# Altium project 8x8_Crosspoint_Switch.PrjPcb (part 2 of 4)

## Sheet 1-to-8_Fanout.SchDoc: 1:8 Fanout
size A3; Author: M.Beldyga; CompanyName: WUT ISE; DrawnBy: M.Beldyga; Organization: WUT ISE; Address1: PW ISE; Address2: Nowowiejska 15/19 00-665 Warsaw; Address3: micbeldyga@gmail.com; SheetNumber: 3; SheetTotal: 8; ModifiedBy: -; CheckedDate: -; DivGrp: WUT ISE; Designer: M.Beldyga; ModifiedDate: -; ProjectName: Sensor Box
Used 8 times, as channels U_Crosspoint/U_1-to-8_Fanout, U_Crosspoint/U_1-to-8_Fanout, U_Crosspoint/U_1-to-8_Fanout, U_Crosspoint/U_1-to-8_Fanout, U_Crosspoint/U_1-to-8_Fanout, U_Crosspoint/U_1-to-8_Fanout, U_Crosspoint/U_1-to-8_Fanout, U_Crosspoint/U_1-to-8_Fanout. Parts and nets are listed once, with the designators drawn on the sheet.
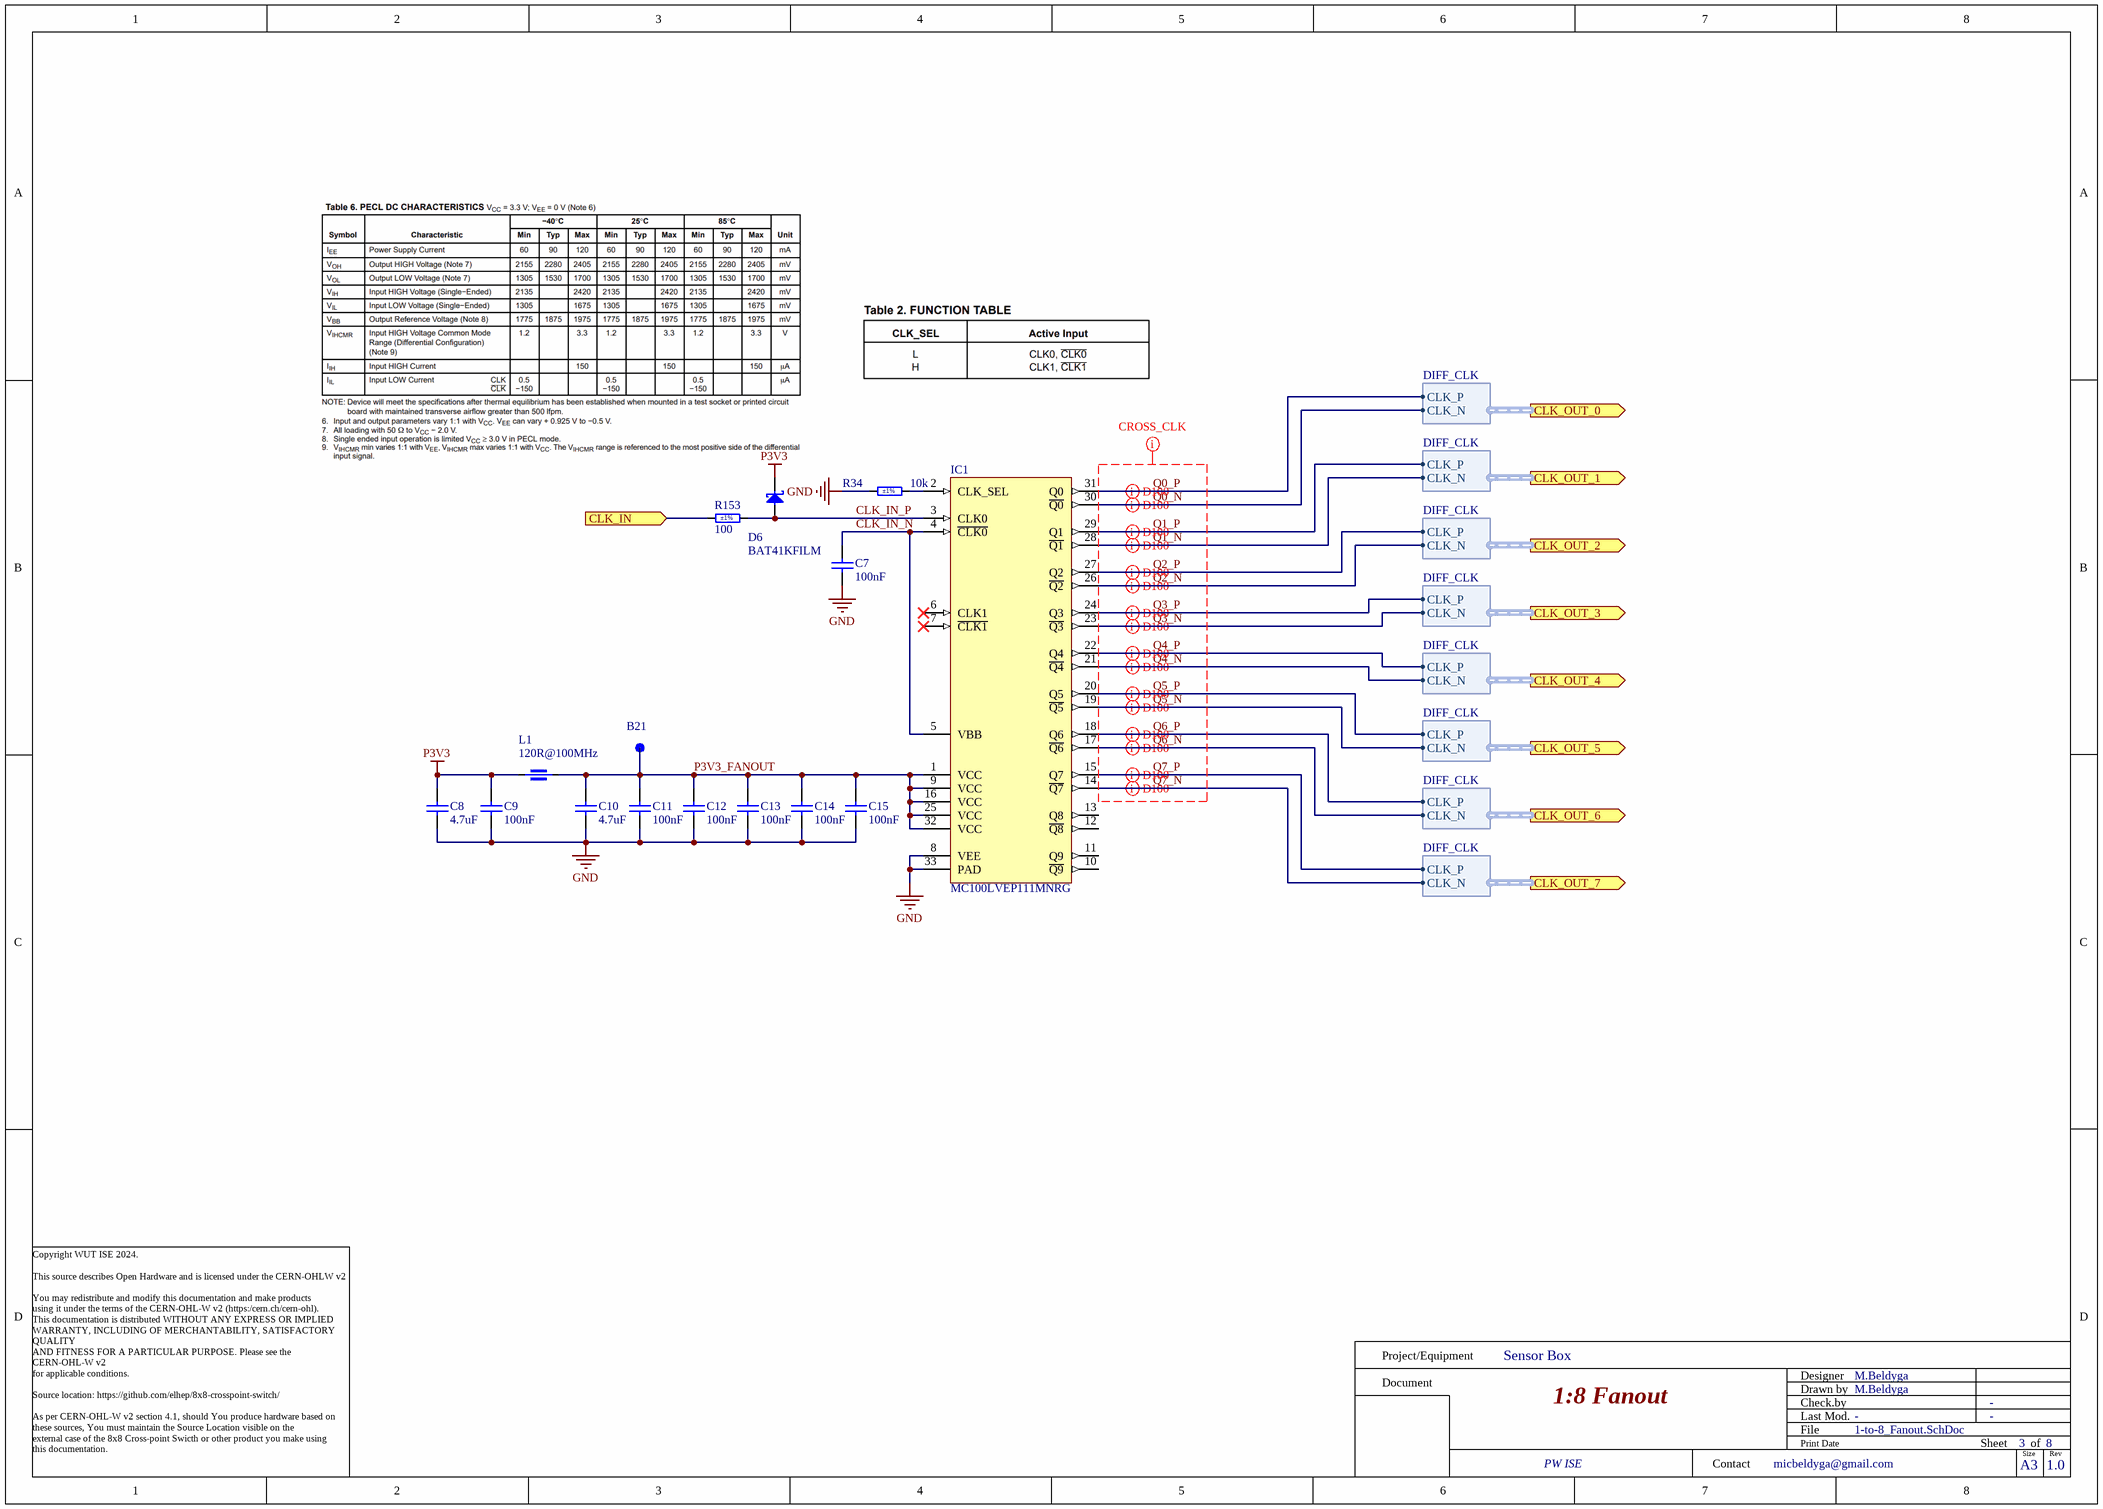
[diagram p2: 1-to-8_Fanout.SchDoc]

### Parts
B21  SMD Pad  [C100]  (value not drawn)  (no BOM)
C7  100nF  [CAPC1005X55N]
C8  4.7uF  [CAPC1608X90N]
C9  100nF  [CAPC1005X55N]
C10  4.7uF  [CAPC1608X90N]
C11  100nF  [CAPC1005X55N]
C12  100nF  [CAPC1005X55N]
C13  100nF  [CAPC1005X55N]
C14  100nF  [CAPC1005X55N]
C15  100nF  [CAPC1005X55N]
D6  BAT41KFILM  [SODFL1608X70N]
IC1  MC100LVEP111MNRG  [QFN50P500X500X100_HS-33N]
L1  120R@100MHz  [INDC1608X65N]
R34  10k  Tolerance: ±1%  [RESC1005X40N]
R153  100  Tolerance: ±1%  [RESC1005X40N]

### Ports
CLK_IN (in), CLK_OUT_0 (out, harness DIFF_CLK), CLK_OUT_1 (out, harness DIFF_CLK), CLK_OUT_2 (out, harness DIFF_CLK), CLK_OUT_3 (out, harness DIFF_CLK), CLK_OUT_4 (out, harness DIFF_CLK), CLK_OUT_5 (out, harness DIFF_CLK), CLK_OUT_6 (out, harness DIFF_CLK), CLK_OUT_7 (out, harness DIFF_CLK)

### Harnesses
DIFF_CLK: CLK_P, CLK_N

### Nets
GND: C7.1 C8.1 C9.1 C10.1 C11.1 C12.1 C13.1 C14.1 C15.1 IC1.8(VEE) IC1.33(PAD) R34.2
P3V3: C8.2 C9.2 D6.1(C) L1.1
CLK_IN: R153.1 ; port CLK_IN
CLK_IN_N: C7.2 IC1.4(~{CLK0}) IC1.5(VBB)
CLK_IN_P: D6.2(A) IC1.3(CLK0) R153.2
P3V3_FANOUT: B21.1 C10.2 C11.2 C12.2 C13.2 C14.2 C15.2 IC1.1(VCC) IC1.9(VCC) IC1.16(VCC) IC1.25(VCC) IC1.32(VCC) L1.2
Q0_N: IC1.30(~{Q0}) ; port CLK_OUT_0.CLK_N
Q0_P: IC1.31(Q0) ; port CLK_OUT_0.CLK_P
Q1_N: IC1.28(~{Q1}) ; port CLK_OUT_1.CLK_N
Q1_P: IC1.29(Q1) ; port CLK_OUT_1.CLK_P
Q2_N: IC1.26(~{Q2}) ; port CLK_OUT_2.CLK_N
Q2_P: IC1.27(Q2) ; port CLK_OUT_2.CLK_P
Q3_N: IC1.23(~{Q3}) ; port CLK_OUT_3.CLK_N
Q3_P: IC1.24(Q3) ; port CLK_OUT_3.CLK_P
Q4_N: IC1.21(~{Q4}) ; port CLK_OUT_4.CLK_N
Q4_P: IC1.22(Q4) ; port CLK_OUT_4.CLK_P
Q5_N: IC1.19(~{Q5}) ; port CLK_OUT_5.CLK_N
Q5_P: IC1.20(Q5) ; port CLK_OUT_5.CLK_P
Q6_N: IC1.17(~{Q6}) ; port CLK_OUT_6.CLK_N
Q6_P: IC1.18(Q6) ; port CLK_OUT_6.CLK_P
Q7_N: IC1.14(~{Q7}) ; port CLK_OUT_7.CLK_N
Q7_P: IC1.15(Q7) ; port CLK_OUT_7.CLK_P
NetIC1_2: IC1.2(CLK_SEL) R34.1

Not connected (* = marked no-connect by the designer): IC1 6(CLK1)* 7(~{CLK1})* 10(~{Q9}) 11(Q9) 12(~{Q8}) 13(Q8)

### Channels
U_Crosspoint/U_1-to-8_Fanout: designators end in A; ports CLK_IN=CLK_IN_0
U_Crosspoint/U_1-to-8_Fanout: designators end in B; ports CLK_IN=CLK_IN_1
U_Crosspoint/U_1-to-8_Fanout: designators end in C; ports CLK_IN=CLK_IN_2
U_Crosspoint/U_1-to-8_Fanout: designators end in D; ports CLK_IN=CLK_IN_3
U_Crosspoint/U_1-to-8_Fanout: designators end in E; ports CLK_IN=CLK_IN_4
U_Crosspoint/U_1-to-8_Fanout: designators end in F; ports CLK_IN=CLK_IN_5
U_Crosspoint/U_1-to-8_Fanout: designators end in G; ports CLK_IN=CLK_IN_6
U_Crosspoint/U_1-to-8_Fanout: designators end in H; ports CLK_IN=CLK_IN_7

### Layout directives
differential pair; net class D100: CLK_0_OUT_0.CLK_N, CLK_0_OUT_0.CLK_P, CLK_0_OUT_1.CLK_N, CLK_0_OUT_1.CLK_P, CLK_0_OUT_2.CLK_N, CLK_0_OUT_2.CLK_P, CLK_0_OUT_3.CLK_N, CLK_0_OUT_3.CLK_P, CLK_0_OUT_4.CLK_N, CLK_0_OUT_4.CLK_P, CLK_0_OUT_5.CLK_N, CLK_0_OUT_5.CLK_P, CLK_0_OUT_6.CLK_N, CLK_0_OUT_6.CLK_P, CLK_0_OUT_7.CLK_N, CLK_0_OUT_7.CLK_P
net class CROSS_CLK: Q0_N, Q0_P, Q1_N, Q1_P, Q2_N, Q2_P, Q3_N, Q3_P, Q4_N, Q4_P, Q5_N, Q5_P, Q6_N, Q6_P, Q7_N, Q7_P

### Notes on the sheet
- Copyright WUT ISE 2024.
  This source describes Open Hardware and is licensed under the CERN-OHLW v2
  You may redistribute and modify this documentation and make products
  using it under the terms of the CERN-OHL-W v2 (https:/cern.ch/cern-ohl).
  This documentation is distributed WITHOUT ANY EXPRESS OR IMPLIED
  WARRANTY, INCLUDING OF MERCHANTABILITY, SATISFACTORY QUALITY
  AND FITNESS FOR A PARTICULAR PURPOSE. Please see the CERN-OHL-W v2
  for applicable conditions.
  Source location: https://github.com/elhep/8x8-crosspoint-switch/
  As per CERN-OHL-W v2 section 4.1, should You produce hardware based on
  these sources, You must maintain the Source Location visible on the
  external case of the 8x8 Cross-point Swicth or other product you make using
  this documentation.
- Project/Equipment
- Document
- Designer
- Drawn by
- Check.by
- Contact
- File
- Last Mod.
- Print Date
- Sheet
- Size
- A3
- of
- Rev

### Library data of the parts
B21 = SMD_PAD_D1MM: as B8 on sheet 8x8_Crosspoint; Part Number: SMD_PAD_D1MM; Component Type: Standard (No BOM); Pin Count: 1; Family: SMD Pad; Socket: No; SMD: Yes; Sense: No; Status: None; ComponentHeight: 0mm; HelpURL: Undefined; Author: CERN DEM JLC; CreateDate: 10/10/2017; LatestRevisionDate: 10/10/2017; PackageDescription: 1mm Diameter SMD Pad
C7 C9 C11-C15 = CC0402_100NF_50V_10%_X7R: as C3 on sheet 8x8_Crosspoint; Part Number: CC0402_100NF_50V_10%_X7R; Component Kind: Standard; Component Type: Standard; Pin Count: 2; Value: 100nF; Status: None; Manufacturer Part Number: CC0402_100NF_50V_10%_X7R; Case: 0402; Mounted: Yes; Socket: No; SMD: Yes; Sense: No; Manufacturer1 Example: MURATA; Manufacturer1 ComponentHeight: 0.55mm; HelpURL: \\cern.ch\dfs\Applications\Altium\Datasheets\CC0402_MURATA_GRM155R71H104KE14D.pdf; Author: CERN DEM MR; CreateDate: 6/30/2017; LatestRevisionDate: 6/30/2017
C8 C10 = CC0603_4.7UF_25V_10%_X5R: Non-polarised capacitor; Part Description: SMD Multilayer Chip Ceramic Capacitor; Manufacturer: GENERIC; Manufacturer1 Part Number: GRM188R61E475KE11D; Voltage: 25V; TC: X5R; Tolerance: ±10%; Part Number: CC0603_4.7UF_25V_10%_X5R; Component Kind: Standard; Component Type: Standard; Pin Count: 2; Value: 4.7uF; Status: None; Manufacturer Part Number: CC0603_4.7UF_25V_10%_X5R; Case: 0603; Mounted: Yes; Socket: No; SMD: Yes; Sense: No; Manufacturer1 Example: MURATA; Manufacturer1 ComponentHeight: 0.95mm; HelpURL: \\cern.ch\dfs\Applications\Altium\Datasheets\CC0603_MURATA_GRM188R61E475KE11D.pdf; Author: CERN DEM JLC; CreateDate: 11/10/2014; LatestRevisionDate: 11/10/2014
D6 = BAT41KFILM: Low Capacitance Small Signal 200 mA 1 V Schottky Diode Surface Mount - SOD-523; Manufacturer: STMicroelectronics; Supplier: Mouser; Supplier Part Number: 511-BAT41KFILM; Manufacturer Part Number: BAT41KFILM; RoHS: Yes; Category: Rectifier Diodes; Stock: 214027; Pricing: 1=0.38, 10=0.264, 50=0.264, 100=0.109, 1000=0.081, 10000=0.056 (USD); ComponentLink1URL: https://datasheet.ciiva.com/22733/1689714-22733174.pdf?src-supplier=Element14; ComponentLink1Description: https://datasheet.ciiva.com/22733/1689714-22733174.pdf?src-supplier=Element14; ComponentLink2URL: https://datasheet.ciiva.com/16421/cd00130227-16421663.pdf?src-supplier=Future+Electronics; ComponentLink2Description: https://datasheet.ciiva.com/16421/cd00130227-16421663.pdf?src-supplier=Future+Electronics; ComponentLink3URL: https://datasheet.ciiva.com/915/cd00130227-915701.pdf?src-supplier=Digikey; ComponentLink3Description: https://datasheet.ciiva.com/915/cd00130227-915701.pdf?src-supplier=Digikey; ComponentLink4URL: https://datasheet.ciiva.com/915/cd00130227-915702.pdf?src-supplier=Digikey; ComponentLink4Description: https://datasheet.ciiva.com/915/cd00130227-915702.pdf?src-supplier=Digikey; ComponentLink5URL: https://datasheet.ciiva.com/915/cd00130227-915703.pdf?src-supplier=Digikey; ComponentLink5Description: https://datasheet.ciiva.com/915/cd00130227-915703.pdf?src-supplier=Digikey
IC1 = MC100LVEP111MNRG: 2.5 V / 3.3 V 2: 1: 10 Differential ECL/PECL/HSTL Clock / Data Fanout Buffer; Manufacturer: ON Semiconductor; Supplier: Digikey; Supplier Part Number: 488-MC100LVEP111MNRGCT-ND; Manufacturer Part Number: MC100LVEP111MNRG; RoHS: Yes; Category: Clock Buffers, Drivers; Stock: 1000; Pricing: 1=7.77, 10=7.02, 25=6.6932, 100=5.8117, 250=5.55056, 500=5.0608 (USD); ComponentLink1URL: https://datasheet.ciiva.com/8255/mc100lvep111-d-8255826.pdf?src-supplier=Avnet; ComponentLink1Description: https://datasheet.ciiva.com/8255/mc100lvep111-d-8255826.pdf?src-supplier=Avnet; ComponentLink2URL: https://datasheet.ciiva.com/6671/mc100lvep111-d-6671100.pdf?src-supplier=Digikey; ComponentLink2Description: https://datasheet.ciiva.com/6671/mc100lvep111-d-6671100.pdf?src-supplier=Digikey
L1 = IND0603_MURATA_BLM18SG121TN1D: Part Description: SMD EMIFIL Suppression Chip Ferrite Bead; Manufacturer: MURATA; Power: 3A; Resistance: 0.025R; Tolerance: ±25%; Part Number: IND0603_MURATA_BLM18SG121TN1D; Component Kind: Standard; Component Type: Standard; Pin Count: 2; Value: 120R@100MHz; Manufacturer Part Number: BLM18SG121TN1D; Case: 0603; Mounted: Yes; Socket: No; SMD: Yes; Sense: No; ComponentHeight: 0.65mm; HelpURL: \\cern.ch\dfs\Applications\Altium\Datasheets\IND0603_MURATA_BLM18S.pdf; Author: CERN DEM JLC; CreateDate: 7/23/2014; LatestRevisionDate: 10/25/2018
R34 = R0402_10K_1%_0.0625W_100PPM: as R17 on sheet 8x8_Crosspoint; Part Number: R0402_10K_1%_0.0625W_100PPM; Component Kind: Standard; Component Type: Standard; Pin Count: 2; Value: 10k; Status: Not Recommended; Power: 0.0625W; Manufacturer Part Number: R0402_10K_1%_0.0625W_100PPM; Case: 0402; Mounted: Yes; Sense: No; Socket: No; SMD: Yes; Manufacturer1 Example: YAGEO PHYCOMP; Manufacturer1 ComponentHeight: 0.4mm; HelpURL: \\cern.ch\dfs\Applications\Altium\Datasheets\R0402_Phycomp_RC0402.pdf; Author: CERN DEM JLC; CreateDate: 12/3/2007; LatestRevisionDate: 10/17/2012
R153 = R0402_100R_1%_0.1W_100PPM: Resistor - 1%; Part Description: General Purpose Thick Film Chip Resistor; Manufacturer: GENERIC; Manufacturer Part Number: R0402_100R_1%_0.1W_100PPM_50V; Manufacturer1 Part Number: ERJ2RKF1000X; Power: 0.1W; TC: ±100ppm/°C; Voltage: 50V; PressFit: No; Part Number: R0402_100R_1%_0.1W_100PPM; Component Kind: Standard; Component Type: Standard; Pin Count: 2; Value: 100; Status: Not Recommended; Case: 0402; Mounted: Yes; Sense: No; Socket: No; SMD: Yes; Manufacturer1 Example: PANASONIC; Manufacturer1 ComponentHeight: 0.4mm; HelpURL: \\cern.ch\dfs\Applications\Altium\Datasheets\R0402_PANASONIC_ERJ2RK.pdf; Author: CERN DEM JLC; CreateDate: 12/12/2013; LatestRevisionDate: 3/3/2015

## Sheet 8-to-1_MUX.SchDoc: 8:1 MUX
size A3; Author: M.Beldyga; CompanyName: WUT ISE; DrawnBy: M.Beldyga; Organization: WUT ISE; Address1: PW ISE; Address2: Nowowiejska 15/19 00-665 Warsaw; Address3: micbeldyga@gmail.com; SheetNumber: 4; SheetTotal: 8; ModifiedBy: -; CheckedDate: -; DivGrp: WUT ISE; Designer: M.Beldyga; ModifiedDate: -; ProjectName: Sensor Box
Used 8 times, as channels U_Crosspoint/U_8-to-1_MUX, U_Crosspoint/U_8-to-1_MUX, U_Crosspoint/U_8-to-1_MUX, U_Crosspoint/U_8-to-1_MUX, U_Crosspoint/U_8-to-1_MUX, U_Crosspoint/U_8-to-1_MUX, U_Crosspoint/U_8-to-1_MUX, U_Crosspoint/U_8-to-1_MUX. Parts and nets are listed once, with the designators drawn on the sheet.
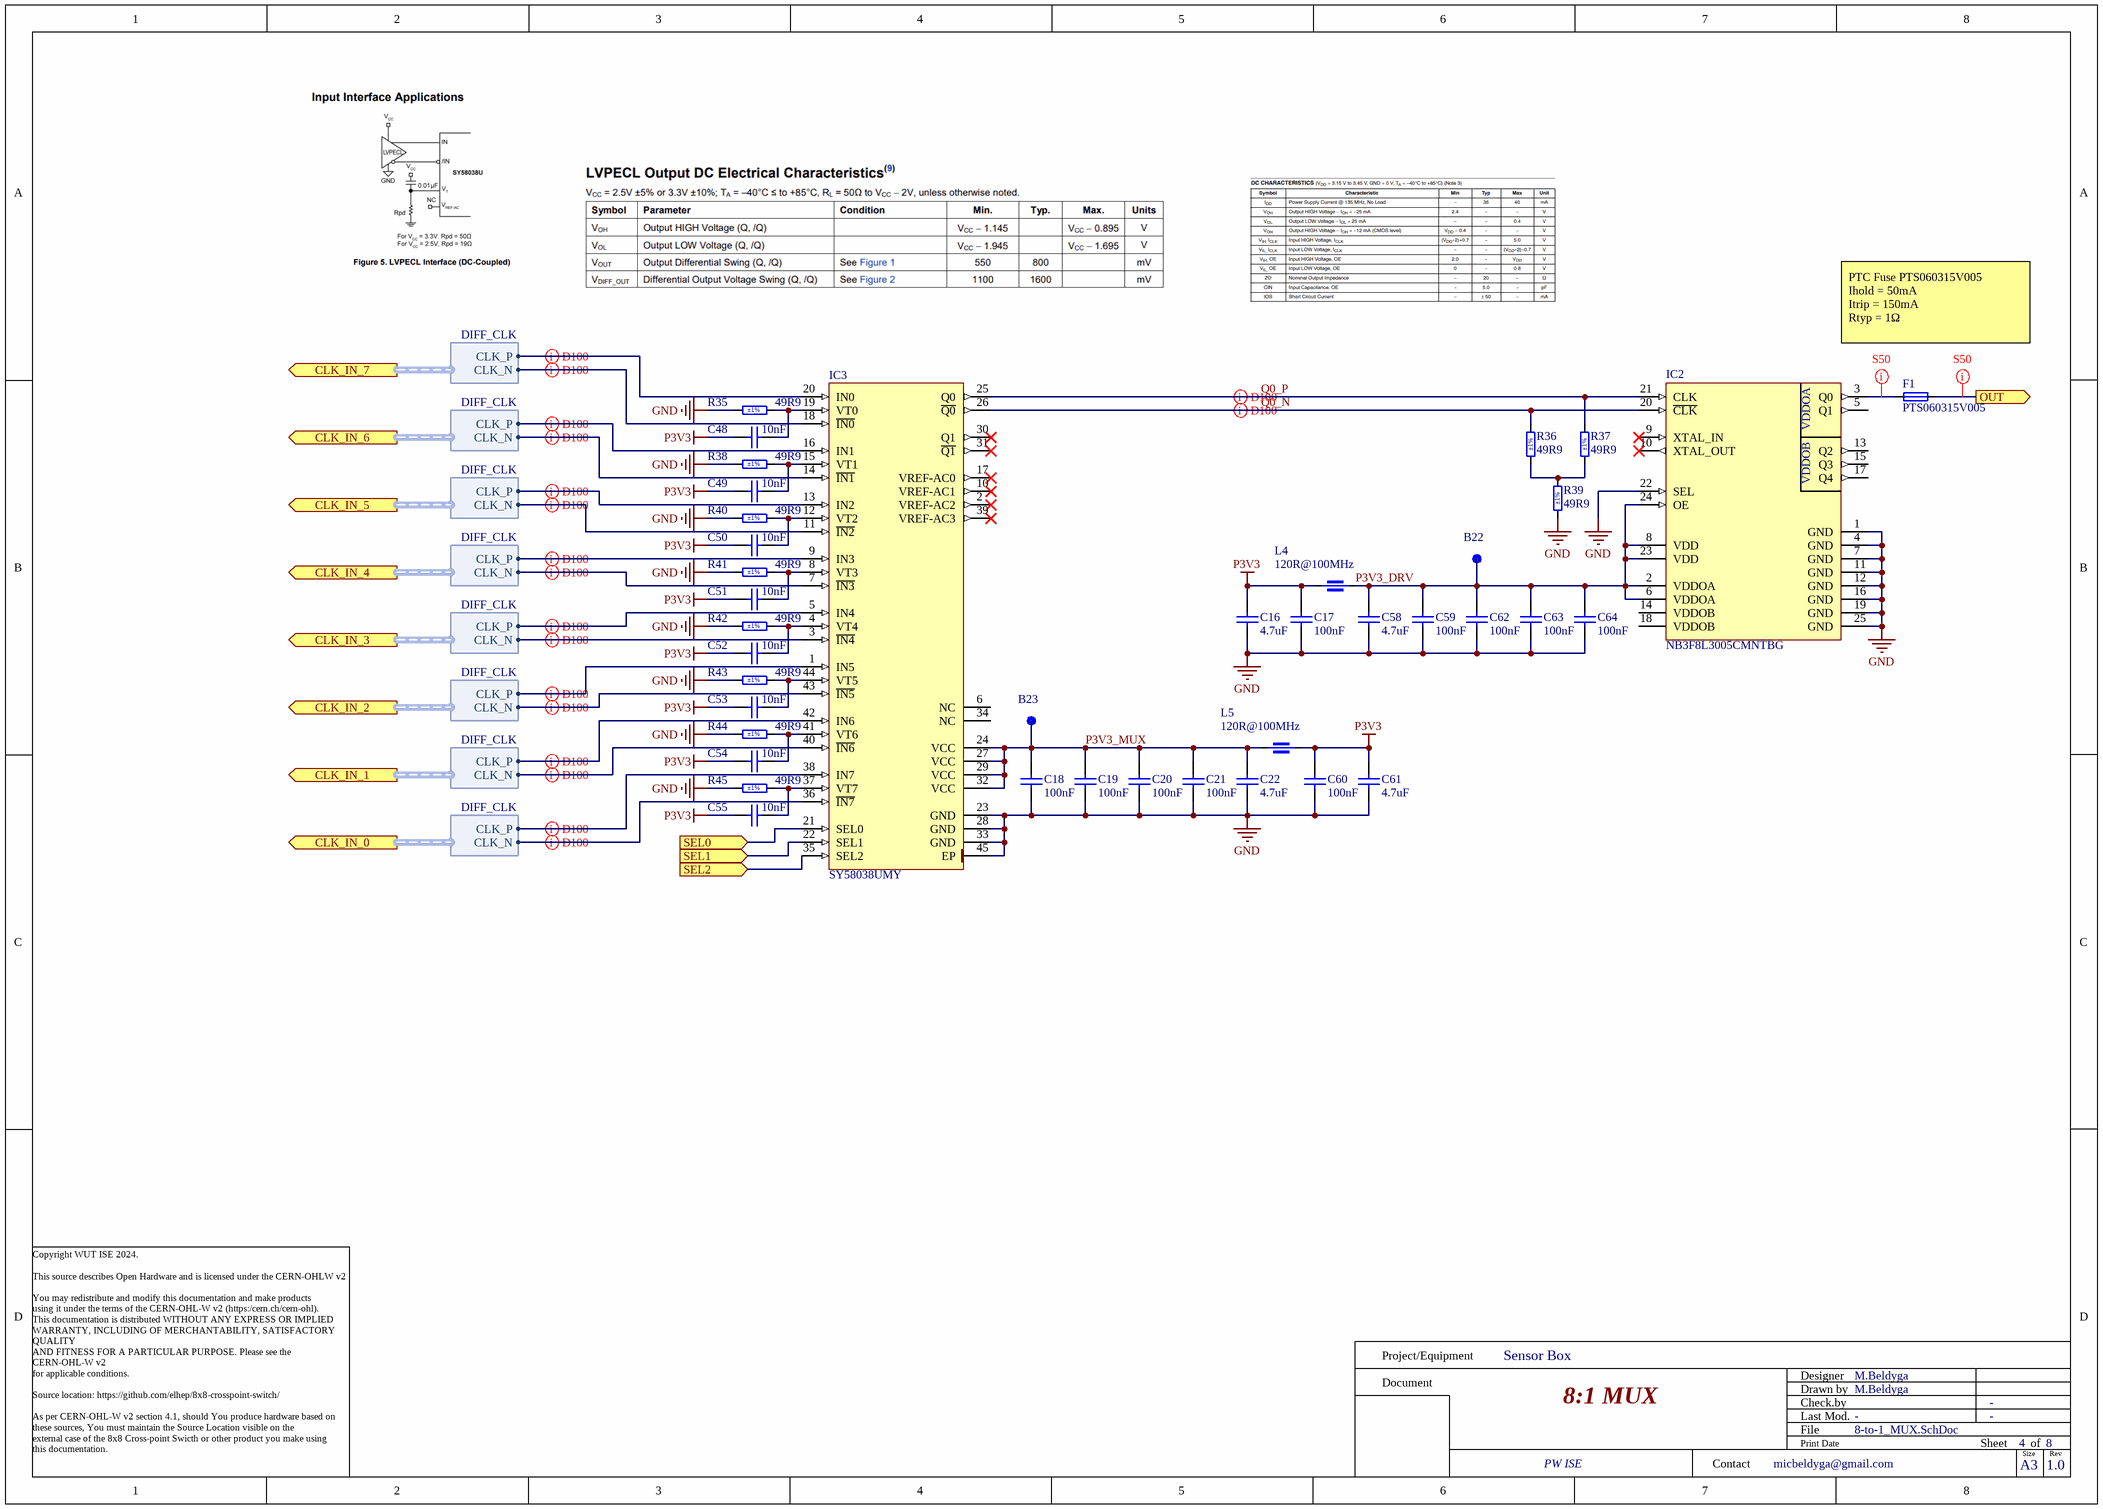
[diagram p3: 8-to-1_MUX.SchDoc]

### Parts
B22  SMD Pad  [C100]  (value not drawn)  (no BOM)
B23  SMD Pad  [C100]  (value not drawn)  (no BOM)
C16  4.7uF  [CAPC1608X90N]
C17  100nF  [CAPC1005X55N]
C18  100nF  [CAPC1005X55N]
C19  100nF  [CAPC1005X55N]
C20  100nF  [CAPC1005X55N]
C21  100nF  [CAPC1005X55N]
C22  4.7uF  [CAPC1608X90N]
C48  10nF  [CAPC1005X55N]
C49  10nF  [CAPC1005X55N]
C50  10nF  [CAPC1005X55N]
C51  10nF  [CAPC1005X55N]
C52  10nF  [CAPC1005X55N]
C53  10nF  [CAPC1005X55N]
C54  10nF  [CAPC1005X55N]
C55  10nF  [CAPC1005X55N]
C58  4.7uF  [CAPC1608X90N]
C59  100nF  [CAPC1005X55N]
C60  100nF  [CAPC1005X55N]
C61  4.7uF  [CAPC1608X90N]
C62  100nF  [CAPC1005X55N]
C63  100nF  [CAPC1005X55N]
C64  100nF  [CAPC1005X55N]
F1  PTS060315V005  [CAPC1709X08N]
IC2  NB3F8L3005CMNTBG  [QFN50P400X400X90_HS-25N]
IC3  SY58038UMY  [QFN50P700X700X100-45N-S340]
L4  120R@100MHz  [INDC1608X65N]
L5  120R@100MHz  [INDC1608X65N]
R35  49R9  Tolerance: ±1%  [RESC1005X40N]
R36  49R9  Tolerance: ±1%  [RESC1005X40N]
R37  49R9  Tolerance: ±1%  [RESC1005X40N]
R38  49R9  Tolerance: ±1%  [RESC1005X40N]
R39  49R9  Tolerance: ±1%  [RESC1005X40N]
R40  49R9  Tolerance: ±1%  [RESC1005X40N]
R41  49R9  Tolerance: ±1%  [RESC1005X40N]
R42  49R9  Tolerance: ±1%  [RESC1005X40N]
R43  49R9  Tolerance: ±1%  [RESC1005X40N]
R44  49R9  Tolerance: ±1%  [RESC1005X40N]
R45  49R9  Tolerance: ±1%  [RESC1005X40N]

### Ports
CLK_IN_0 (out, harness DIFF_CLK), CLK_IN_1 (out, harness DIFF_CLK), CLK_IN_2 (out, harness DIFF_CLK), CLK_IN_3 (out, harness DIFF_CLK), CLK_IN_4 (out, harness DIFF_CLK), CLK_IN_5 (out, harness DIFF_CLK), CLK_IN_6 (out, harness DIFF_CLK), CLK_IN_7 (out, harness DIFF_CLK), OUT (out), SEL0 (in), SEL1 (in), SEL2 (in)

### Harnesses
DIFF_CLK: CLK_P, CLK_N

### Nets
GND: C16.1 C17.1 C18.1 C19.1 C20.1 C21.1 C22.1 C58.1 C59.1 C60.1 C61.1 C62.1 C63.1 C64.1 IC2.1(GND) IC2.4(GND) IC2.7(GND) IC2.11(GND) IC2.12(GND) IC2.16(GND) IC2.19(GND) IC2.22(SEL) IC2.25(GND) IC3.23(GND) IC3.28(GND) IC3.33(GND) IC3.45(EP) R35.1 R38.1 R39.1 R40.1 R41.1 R42.1 R43.1 R44.1 R45.1
P3V3: C16.2 C17.2 C48.2 C49.2 C50.2 C51.2 C52.2 C53.2 C54.2 C55.2 C60.2 C61.2 L4.1 L5.2
OUT: F1.2 ; port OUT
P3V3_DRV: B22.1 C58.2 C59.2 C62.2 C63.2 C64.2 IC2.2(VDDOA) IC2.6(VDDOA) IC2.8(VDD) IC2.23(VDD) IC2.24(OE) L4.2
P3V3_MUX: B23.1 C18.2 C19.2 C20.2 C21.2 C22.2 IC3.24(VCC) IC3.27(VCC) IC3.29(VCC) IC3.32(VCC) L5.1
Q0_N: IC2.20(~{CLK}) IC3.26(~{Q0}) R36.2
Q0_P: IC2.21(CLK) IC3.25(Q0) R37.2
SEL0: IC3.21(SEL0) ; port SEL0
SEL1: IC3.22(SEL1) ; port SEL1
SEL2: IC3.35(SEL2) ; port SEL2
NetC48_1: C48.1 IC3.19(VT0) R35.2
NetC49_1: C49.1 IC3.15(VT1) R38.2
NetC50_1: C50.1 IC3.12(VT2) R40.2
NetC51_1: C51.1 IC3.8(VT3) R41.2
NetC52_1: C52.1 IC3.4(VT4) R42.2
NetC53_1: C53.1 IC3.44(VT5) R43.2
NetC54_1: C54.1 IC3.41(VT6) R44.2
NetC55_1: C55.1 IC3.37(VT7) R45.2
NetF1_1: F1.1 IC2.3(Q0)
NetIC3_1: IC3.1(IN5) ; port CLK_IN_2.CLK_P
NetIC3_3: IC3.3(~{IN4}) ; port CLK_IN_3.CLK_N
NetIC3_5: IC3.5(IN4) ; port CLK_IN_3.CLK_P
NetIC3_7: IC3.7(~{IN3}) ; port CLK_IN_4.CLK_N
NetIC3_9: IC3.9(IN3) ; port CLK_IN_4.CLK_P
NetIC3_11: IC3.11(~{IN2}) ; port CLK_IN_5.CLK_N
NetIC3_13: IC3.13(IN2) ; port CLK_IN_5.CLK_P
NetIC3_14: IC3.14(~{IN1}) ; port CLK_IN_6.CLK_N
NetIC3_16: IC3.16(IN1) ; port CLK_IN_6.CLK_P
NetIC3_18: IC3.18(~{IN0}) ; port CLK_IN_7.CLK_N
NetIC3_20: IC3.20(IN0) ; port CLK_IN_7.CLK_P
NetIC3_36: IC3.36(~{IN7}) ; port CLK_IN_0.CLK_N
NetIC3_38: IC3.38(IN7) ; port CLK_IN_0.CLK_P
NetIC3_40: IC3.40(~{IN6}) ; port CLK_IN_1.CLK_N
NetIC3_42: IC3.42(IN6) ; port CLK_IN_1.CLK_P
NetIC3_43: IC3.43(~{IN5}) ; port CLK_IN_2.CLK_N
NetR36_1: R36.1 R37.1 R39.2

Not connected (* = marked no-connect by the designer): IC2 5(Q1) 9(XTAL_IN)* 10(XTAL_OUT)* 13(Q2) 14(VDDOB) 15(Q3) 17(Q4) 18(VDDOB); IC3 2(VREF-AC2)* 6(NC) 10(VREF-AC1)* 17(VREF-AC0)* 30(Q1)* 31(~{Q1})* 34(NC) 39(VREF-AC3)*

### Channels
U_Crosspoint/U_8-to-1_MUX: designators end in A; ports OUT=CLK_OUT_0 SEL0=OUT_0_SEL_0 SEL1=OUT_0_SEL_1 SEL2=OUT_0_SEL_2
U_Crosspoint/U_8-to-1_MUX: designators end in B; ports OUT=CLK_OUT_1 SEL0=OUT_1_SEL_0 SEL1=OUT_1_SEL_1 SEL2=OUT_1_SEL_2
U_Crosspoint/U_8-to-1_MUX: designators end in C; ports OUT=CLK_OUT_2 SEL0=OUT_2_SEL_0 SEL1=OUT_2_SEL_1 SEL2=OUT_2_SEL_2
U_Crosspoint/U_8-to-1_MUX: designators end in D; ports OUT=CLK_OUT_3 SEL0=OUT_3_SEL_0 SEL1=OUT_3_SEL_1 SEL2=OUT_3_SEL_2
U_Crosspoint/U_8-to-1_MUX: designators end in E; ports OUT=CLK_OUT_4 SEL0=OUT_4_SEL_0 SEL1=OUT_4_SEL_1 SEL2=OUT_4_SEL_2
U_Crosspoint/U_8-to-1_MUX: designators end in F; ports OUT=CLK_OUT_5 SEL0=OUT_5_SEL_0 SEL1=OUT_5_SEL_1 SEL2=OUT_5_SEL_2
U_Crosspoint/U_8-to-1_MUX: designators end in G; ports OUT=CLK_OUT_6 SEL0=OUT_6_SEL_0 SEL1=OUT_6_SEL_1 SEL2=OUT_6_SEL_2
U_Crosspoint/U_8-to-1_MUX: designators end in H; ports OUT=CLK_OUT_7 SEL0=OUT_7_SEL_0 SEL1=OUT_7_SEL_1 SEL2=OUT_7_SEL_2

### Layout directives
differential pair; net class D100: CLK_0_OUT_0.CLK_N, CLK_0_OUT_0.CLK_P, CLK_1_OUT_0.CLK_N, CLK_1_OUT_0.CLK_P, CLK_2_OUT_0.CLK_N, CLK_2_OUT_0.CLK_P, CLK_3_OUT_0.CLK_N, CLK_3_OUT_0.CLK_P, CLK_4_OUT_0.CLK_N, CLK_4_OUT_0.CLK_P, CLK_5_OUT_0.CLK_N, CLK_5_OUT_0.CLK_P, CLK_6_OUT_0.CLK_N, CLK_6_OUT_0.CLK_P, CLK_7_OUT_0.CLK_N, CLK_7_OUT_0.CLK_P, Q0_N_U_8-to-1_MUX, Q0_P_U_8-to-1_MUX
net class S50: CLK_OUT_0, NetF1A_1

### Notes on the sheet
- PTC Fuse PTS060315V005
  Ihold = 50mA
  Itrip = 150mA
  Rtyp = 1Ω
- Copyright WUT ISE 2024.
  This source describes Open Hardware and is licensed under the CERN-OHLW v2
  You may redistribute and modify this documentation and make products
  using it under the terms of the CERN-OHL-W v2 (https:/cern.ch/cern-ohl).
  This documentation is distributed WITHOUT ANY EXPRESS OR IMPLIED
  WARRANTY, INCLUDING OF MERCHANTABILITY, SATISFACTORY QUALITY
  AND FITNESS FOR A PARTICULAR PURPOSE. Please see the CERN-OHL-W v2
  for applicable conditions.
  Source location: https://github.com/elhep/8x8-crosspoint-switch/
  As per CERN-OHL-W v2 section 4.1, should You produce hardware based on
  these sources, You must maintain the Source Location visible on the
  external case of the 8x8 Cross-point Swicth or other product you make using
  this documentation.
- Project/Equipment
- Document
- Designer
- Drawn by
- Check.by
- Contact
- File
- Last Mod.
- Print Date
- Sheet
- Size
- A3
- of
- Rev

### Library data of the parts
B22 B23 = SMD_PAD_D1MM: as B8 on sheet 8x8_Crosspoint; Part Number: SMD_PAD_D1MM; Component Type: Standard (No BOM); Pin Count: 1; Family: SMD Pad; Socket: No; SMD: Yes; Sense: No; Status: None; ComponentHeight: 0mm; HelpURL: Undefined; Author: CERN DEM JLC; CreateDate: 10/10/2017; LatestRevisionDate: 10/10/2017; PackageDescription: 1mm Diameter SMD Pad
C16 C22 C58 C61 = CC0603_4.7UF_25V_10%_X5R: as C8 on sheet 1-to-8_Fanout; Part Number: CC0603_4.7UF_25V_10%_X5R; Component Kind: Standard; Component Type: Standard; Pin Count: 2; Value: 4.7uF; Status: None; Manufacturer Part Number: CC0603_4.7UF_25V_10%_X5R; Case: 0603; Mounted: Yes; Socket: No; SMD: Yes; Sense: No; Manufacturer1 Example: MURATA; Manufacturer1 ComponentHeight: 0.95mm; HelpURL: \\cern.ch\dfs\Applications\Altium\Datasheets\CC0603_MURATA_GRM188R61E475KE11D.pdf; Author: CERN DEM JLC; CreateDate: 11/10/2014; LatestRevisionDate: 11/10/2014
C17-C21 C59 C60 C62-C64 = CC0402_100NF_50V_10%_X7R: as C3 on sheet 8x8_Crosspoint; Part Number: CC0402_100NF_50V_10%_X7R; Component Kind: Standard; Component Type: Standard; Pin Count: 2; Value: 100nF; Status: None; Manufacturer Part Number: CC0402_100NF_50V_10%_X7R; Case: 0402; Mounted: Yes; Socket: No; SMD: Yes; Sense: No; Manufacturer1 Example: MURATA; Manufacturer1 ComponentHeight: 0.55mm; HelpURL: \\cern.ch\dfs\Applications\Altium\Datasheets\CC0402_MURATA_GRM155R71H104KE14D.pdf; Author: CERN DEM MR; CreateDate: 6/30/2017; LatestRevisionDate: 6/30/2017
C48-C55 = CC0402_10NF_50V_10%_X7R: Non-polarised capacitor; Part Description: SMD Multilayer Chip Ceramic Capacitor; Manufacturer: GENERIC; Manufacturer1 Part Number: GRM155R71H103KA88D; Voltage: 50V; TC: X7R; Tolerance: ±10%; Part Number: CC0402_10NF_50V_10%_X7R; Component Kind: Standard; Component Type: Standard; Pin Count: 2; Value: 10nF; Status: None; Manufacturer Part Number: CC0402_10NF_50V_10%_X7R; Case: 0402; Mounted: Yes; Socket: No; SMD: Yes; Sense: No; Manufacturer1 Example: MURATA; Manufacturer1 ComponentHeight: 0.55mm; HelpURL: \\cern.ch\dfs\Applications\Altium\Datasheets\CC0402_X7R_MURATA_GRM.pdf; Author: CERN DEM MR; CreateDate: 1/8/2016; LatestRevisionDate: 1/8/2016
F1 = PTS060315V005: Ptc Reset Fuse 50MA 15V 0603; Manufacturer: Eaton Bussmann; Supplier: Mouser; Supplier Part Number: 504-PTS060315V005; Manufacturer Part Number: PTS060315V005; RoHS: No; Category: PTC Resettable Fuses; Stock: 5464; Pricing: 1=0.19, 10=0.16, 50=0.16, 100=0.132, 1000=0.105, 10000=0.065 (USD); ComponentLink1URL: https://datasheet.octopart.com/PTS060315V005-Cooper-Bussmann-datasheet-158256509.pdf?src-supplier=Sager+Electronics; ComponentLink1Description: https://datasheet.octopart.com/PTS060315V005-Cooper-Bussmann-datasheet-158256509.pdf?src-supplier=Sager+Electronics
IC2 = NB3F8L3005CMNTBG: 2: 1: 5 LVCMOS Fanout Buffer, 3.3V / 2.5V / 1.8V / 1.5V; Manufacturer: ON Semiconductor; Supplier: Mouser; Supplier Part Number: 863-NB3F8L3005CMNTBG; Manufacturer Part Number: NB3F8L3005CMNTBG; RoHS: Yes; Category: Clock Buffers, Drivers; Stock: 1836; Pricing: 1=5.88, 10=5.28, 50=4.99, 100=3.72, 1000=3.22, 10000=2.74 (USD); ComponentLink1URL: https://datasheet.ciiva.com/29660/nb3f8l3005c-d-29660305.pdf?src-supplier=Avnet; ComponentLink1Description: https://datasheet.ciiva.com/29660/nb3f8l3005c-d-29660305.pdf?src-supplier=Avnet; ComponentLink2URL: https://datasheet.ciiva.com/30038/nb3f8l3005c-d-30038412.pdf?src-supplier=Avnet; ComponentLink2Description: https://datasheet.ciiva.com/30038/nb3f8l3005c-d-30038412.pdf?src-supplier=Avnet; ComponentLink3URL: https://datasheet.ciiva.com/29660/nb3f8l3005c-d-29660458.pdf?src-supplier=Digikey; ComponentLink3Description: https://datasheet.ciiva.com/29660/nb3f8l3005c-d-29660458.pdf?src-supplier=Digikey; ComponentLink4URL: https://datasheet.ciiva.com/29660/nb3f8l3005c-d-29660459.pdf?src-supplier=Digikey; ComponentLink4Description: https://datasheet.ciiva.com/29660/nb3f8l3005c-d-29660459.pdf?src-supplier=Digikey; ComponentLink5URL: https://datasheet.ciiva.com/29660/nb3f8l3005c-d-29660460.pdf?src-supplier=Digikey; ComponentLink5Description: https://datasheet.ciiva.com/29660/nb3f8l3005c-d-29660460.pdf?src-supplier=Digikey
IC3 = SY58038UMY: Precision Low-Power 8:1 MUX with Internal Termination and 1:2 LVPECL Fanout Buffer; Part Description: Ultra-Precision, 8:1 MUX with Internal Termination and 1:2 LVPECL Fanout Buffer; Manufacturer: MICREL; PressFit: No; Bonding: No; Part Number: SY58038UMY; Component Kind: Standard; Component Type: Standard; Device: SY58038UMY; PackageDescription: QFN, 0.50mm Pitch, Square; 44 Pin, 7.00mm L X 7.00mm W X 1.00mm H body (w/Thermal Tab 3.40 X 3.40mm), IPC Medium Density; Manufacturer Part Number: SY58038UMY; Pin Count: 45; Case: QFN44; Mounted: Yes; Socket: No; SMD: Yes; Sense: No; ComponentHeight: 1mm; Author: CERN DEM HF; HelpURL: \\cern.ch\dfs\Applications\Altium\Datasheets\SY58038U.pdf; CreateDate: 4/17/2023; LatestRevisionDate: 4/17/2023
L4 L5 = IND0603_MURATA_BLM18SG121TN1D: as L1 on sheet 1-to-8_Fanout; Part Number: IND0603_MURATA_BLM18SG121TN1D; Component Kind: Standard; Component Type: Standard; Pin Count: 2; Value: 120R@100MHz; Manufacturer Part Number: BLM18SG121TN1D; Case: 0603; Mounted: Yes; Socket: No; SMD: Yes; Sense: No; ComponentHeight: 0.65mm; HelpURL: \\cern.ch\dfs\Applications\Altium\Datasheets\IND0603_MURATA_BLM18S.pdf; Author: CERN DEM JLC; CreateDate: 7/23/2014; LatestRevisionDate: 10/25/2018
R35-R45 = R0402_49R9_1%_0.0625W_100PPM: Resistor - 1%; Part Description: General Purpose Thick Film Chip Resistor; Manufacturer: GENERIC; Manufacturer1 Part Number: 232270674999L or RC0402FR-0749R9L; TC: ±100ppm/°C; PressFit: No; Part Number: R0402_49R9_1%_0.0625W_100PPM; Component Kind: Standard; Component Type: Standard; Pin Count: 2; Value: 49R9; Status: Not Recommended; Power: 0.0625W; Manufacturer Part Number: R0402_49R9_1%_0.0625W_100PPM; Case: 0402; Mounted: Yes; Sense: No; Socket: No; SMD: Yes; Manufacturer1 Example: YAGEO PHYCOMP; Manufacturer1 ComponentHeight: 0.4mm; HelpURL: \\cern.ch\dfs\Applications\Altium\Datasheets\R0402_Phycomp_RC0402.pdf; Author: CERN DEM JLC; CreateDate: 10/24/2012; LatestRevisionDate: 10/24/2012

## Sheet Crosspoint_control.SchDoc: Cross-point control
size A3; Author: M.Beldyga; CompanyName: WUT ISE; DrawnBy: M.Beldyga; Organization: WUT ISE; Address1: PW ISE; Address2: Nowowiejska 15/19 00-665 Warsaw; Address3: micbeldyga@gmail.com; SheetNumber: 5; SheetTotal: 8; ModifiedBy: -; CheckedDate: -; DivGrp: WUT ISE; Designer: M.Beldyga; ModifiedDate: -; ProjectName: Sensor Box
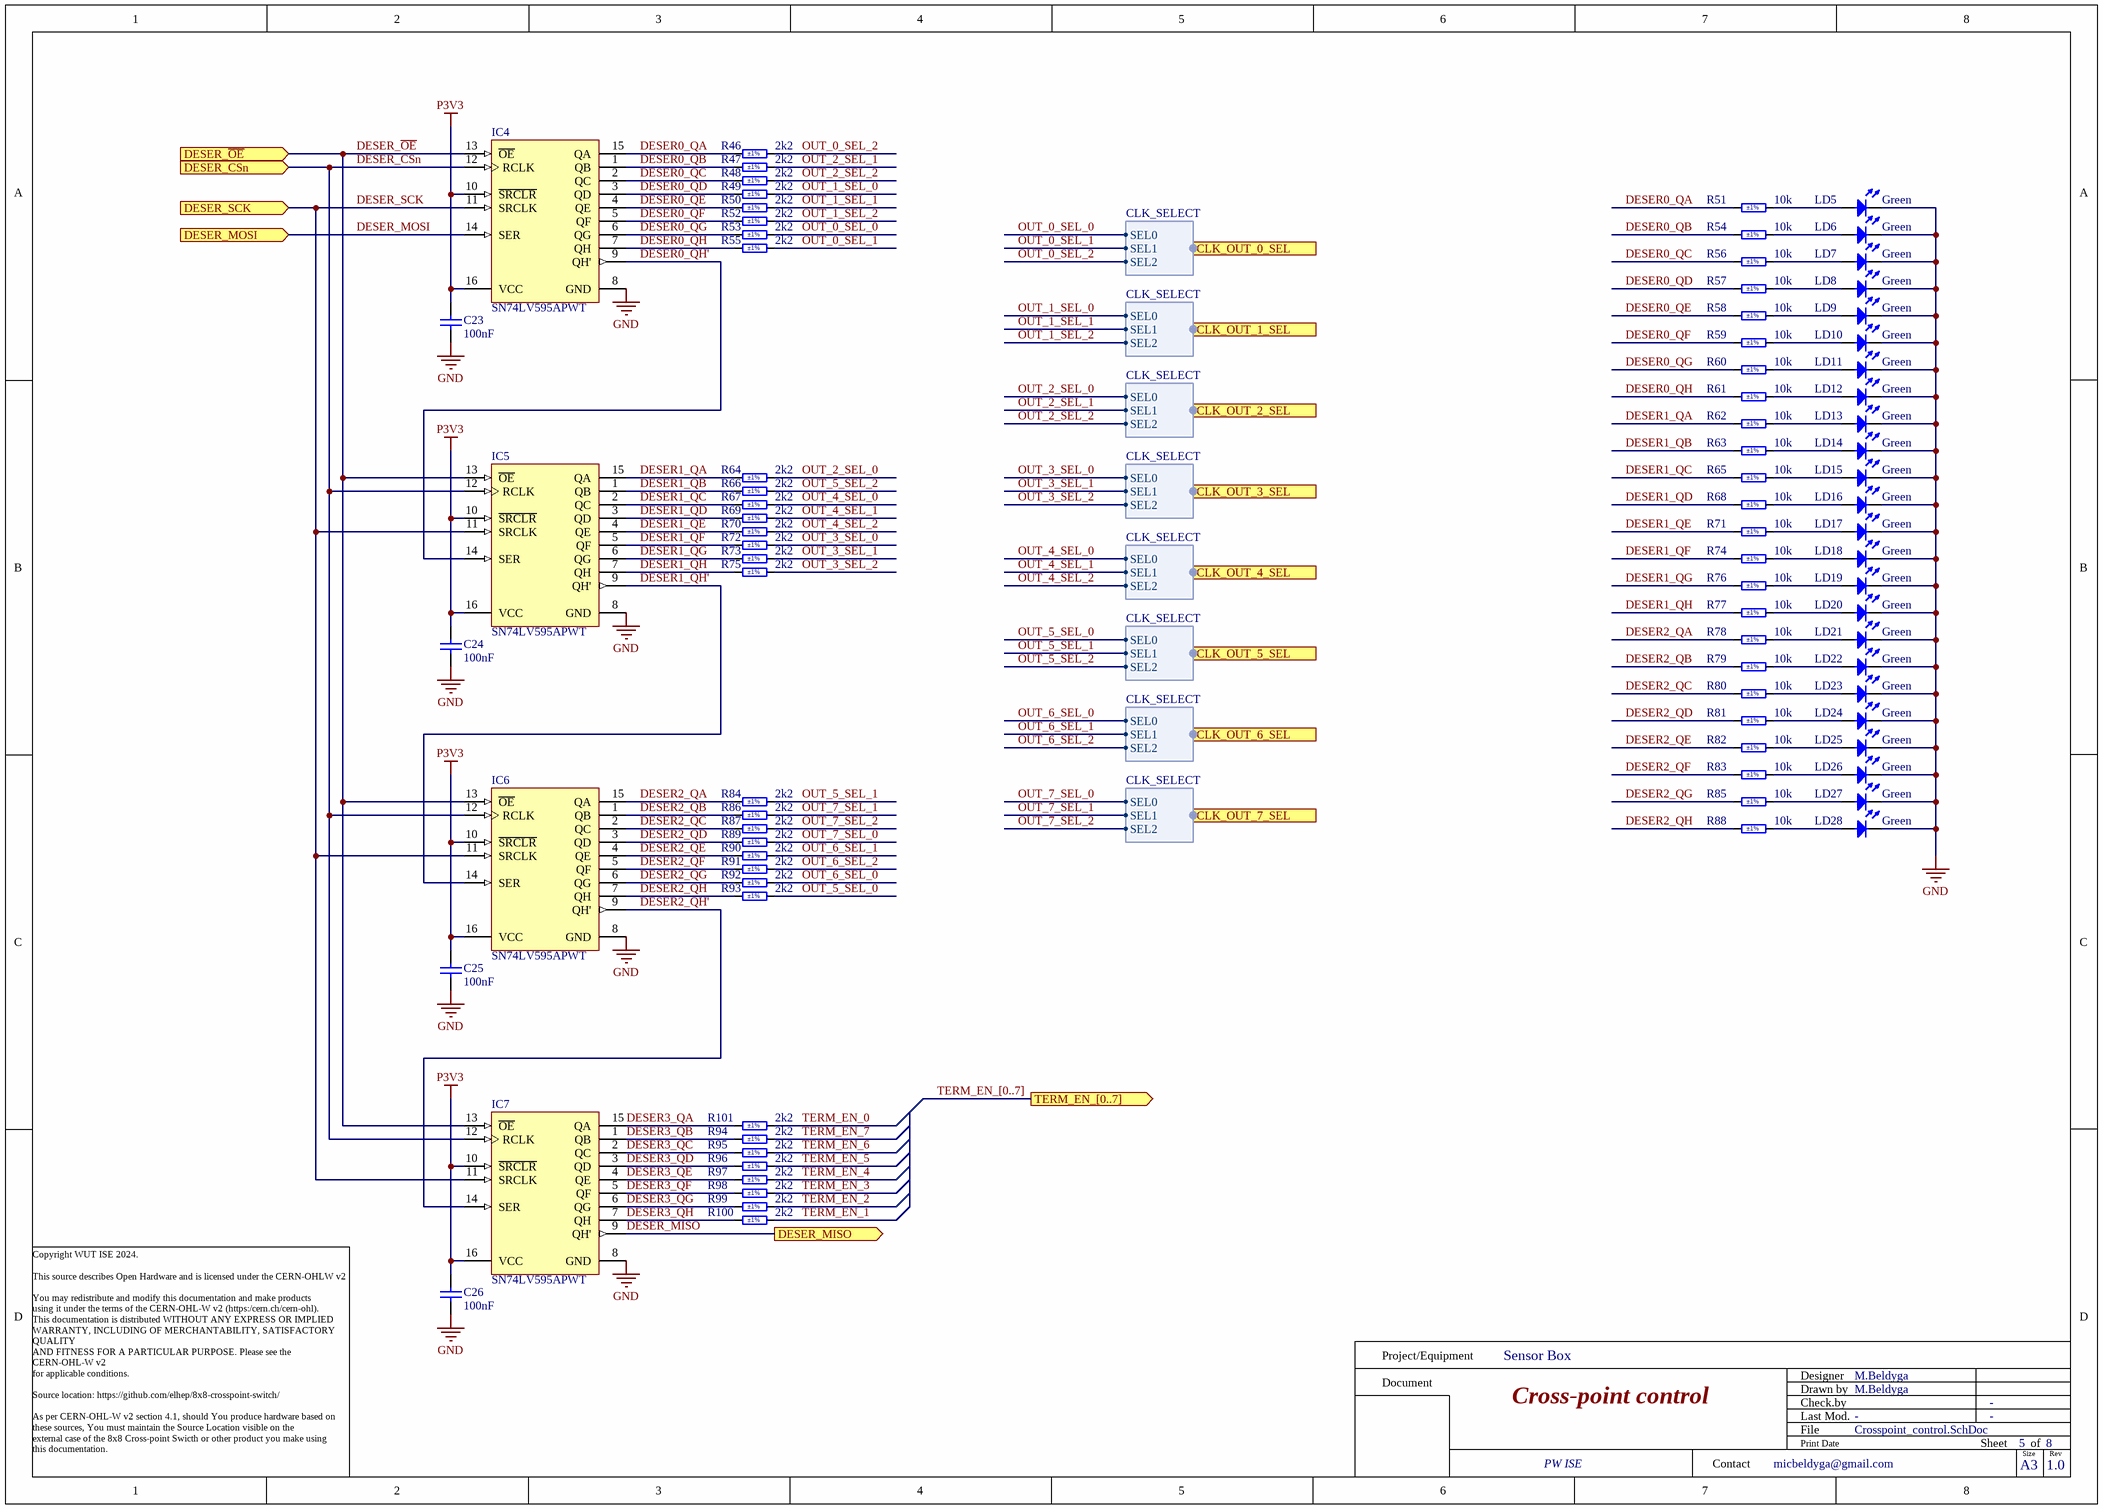
[diagram p4: Crosspoint_control.SchDoc]

### Parts
C23  100nF  [CAPC1005X55N]
C24  100nF  [CAPC1005X55N]
C25  100nF  [CAPC1005X55N]
C26  100nF  [CAPC1005X55N]
IC4  SN74LV595APWT  [SOP65P640X120-16N]
IC5  SN74LV595APWT  [SOP65P640X120-16N]
IC6  SN74LV595APWT  [SOP65P640X120-16N]
IC7  SN74LV595APWT  [SOP65P640X120-16N]
LD5  Green  [LED_KINGBRIGHT_KP-1608CGCK]
LD6  Green  [LED_KINGBRIGHT_KP-1608CGCK]
LD7  Green  [LED_KINGBRIGHT_KP-1608CGCK]
LD8  Green  [LED_KINGBRIGHT_KP-1608CGCK]
LD9  Green  [LED_KINGBRIGHT_KP-1608CGCK]
LD10  Green  [LED_KINGBRIGHT_KP-1608CGCK]
LD11  Green  [LED_KINGBRIGHT_KP-1608CGCK]
LD12  Green  [LED_KINGBRIGHT_KP-1608CGCK]
LD13  Green  [LED_KINGBRIGHT_KP-1608CGCK]
LD14  Green  [LED_KINGBRIGHT_KP-1608CGCK]
LD15  Green  [LED_KINGBRIGHT_KP-1608CGCK]
LD16  Green  [LED_KINGBRIGHT_KP-1608CGCK]
LD17  Green  [LED_KINGBRIGHT_KP-1608CGCK]
LD18  Green  [LED_KINGBRIGHT_KP-1608CGCK]
LD19  Green  [LED_KINGBRIGHT_KP-1608CGCK]
LD20  Green  [LED_KINGBRIGHT_KP-1608CGCK]
LD21  Green  [LED_KINGBRIGHT_KP-1608CGCK]
LD22  Green  [LED_KINGBRIGHT_KP-1608CGCK]
LD23  Green  [LED_KINGBRIGHT_KP-1608CGCK]
LD24  Green  [LED_KINGBRIGHT_KP-1608CGCK]
LD25  Green  [LED_KINGBRIGHT_KP-1608CGCK]
LD26  Green  [LED_KINGBRIGHT_KP-1608CGCK]
LD27  Green  [LED_KINGBRIGHT_KP-1608CGCK]
LD28  Green  [LED_KINGBRIGHT_KP-1608CGCK]
R46  2k2  Tolerance: ±1%  [RESC1005X40N]
R47  2k2  Tolerance: ±1%  [RESC1005X40N]
R48  2k2  Tolerance: ±1%  [RESC1005X40N]
R49  2k2  Tolerance: ±1%  [RESC1005X40N]
R50  2k2  Tolerance: ±1%  [RESC1005X40N]
R51  10k  Tolerance: ±1%  [RESC1005X40N]
R52  2k2  Tolerance: ±1%  [RESC1005X40N]
R53  2k2  Tolerance: ±1%  [RESC1005X40N]
R54  10k  Tolerance: ±1%  [RESC1005X40N]
R55  2k2  Tolerance: ±1%  [RESC1005X40N]
R56  10k  Tolerance: ±1%  [RESC1005X40N]
R57  10k  Tolerance: ±1%  [RESC1005X40N]
R58  10k  Tolerance: ±1%  [RESC1005X40N]
R59  10k  Tolerance: ±1%  [RESC1005X40N]
R60  10k  Tolerance: ±1%  [RESC1005X40N]
R61  10k  Tolerance: ±1%  [RESC1005X40N]
R62  10k  Tolerance: ±1%  [RESC1005X40N]
R63  10k  Tolerance: ±1%  [RESC1005X40N]
R64  2k2  Tolerance: ±1%  [RESC1005X40N]
R65  10k  Tolerance: ±1%  [RESC1005X40N]
R66  2k2  Tolerance: ±1%  [RESC1005X40N]
R67  2k2  Tolerance: ±1%  [RESC1005X40N]
R68  10k  Tolerance: ±1%  [RESC1005X40N]
R69  2k2  Tolerance: ±1%  [RESC1005X40N]
R70  2k2  Tolerance: ±1%  [RESC1005X40N]
R71  10k  Tolerance: ±1%  [RESC1005X40N]
R72  2k2  Tolerance: ±1%  [RESC1005X40N]
R73  2k2  Tolerance: ±1%  [RESC1005X40N]
R74  10k  Tolerance: ±1%  [RESC1005X40N]
R75  2k2  Tolerance: ±1%  [RESC1005X40N]
R76  10k  Tolerance: ±1%  [RESC1005X40N]
R77  10k  Tolerance: ±1%  [RESC1005X40N]
R78  10k  Tolerance: ±1%  [RESC1005X40N]
R79  10k  Tolerance: ±1%  [RESC1005X40N]
R80  10k  Tolerance: ±1%  [RESC1005X40N]
R81  10k  Tolerance: ±1%  [RESC1005X40N]
R82  10k  Tolerance: ±1%  [RESC1005X40N]
R83  10k  Tolerance: ±1%  [RESC1005X40N]
R84  2k2  Tolerance: ±1%  [RESC1005X40N]
R85  10k  Tolerance: ±1%  [RESC1005X40N]
R86  2k2  Tolerance: ±1%  [RESC1005X40N]
R87  2k2  Tolerance: ±1%  [RESC1005X40N]
R88  10k  Tolerance: ±1%  [RESC1005X40N]
R89  2k2  Tolerance: ±1%  [RESC1005X40N]
R90  2k2  Tolerance: ±1%  [RESC1005X40N]
R91  2k2  Tolerance: ±1%  [RESC1005X40N]
R92  2k2  Tolerance: ±1%  [RESC1005X40N]
R93  2k2  Tolerance: ±1%  [RESC1005X40N]
R94  2k2  Tolerance: ±1%  [RESC1005X40N]
R95  2k2  Tolerance: ±1%  [RESC1005X40N]
R96  2k2  Tolerance: ±1%  [RESC1005X40N]
R97  2k2  Tolerance: ±1%  [RESC1005X40N]
R98  2k2  Tolerance: ±1%  [RESC1005X40N]
R99  2k2  Tolerance: ±1%  [RESC1005X40N]
R100  2k2  Tolerance: ±1%  [RESC1005X40N]
R101  2k2  Tolerance: ±1%  [RESC1005X40N]

### Ports
CLK_OUT_0_SEL (out, harness CLK_SELECT), CLK_OUT_1_SEL (out, harness CLK_SELECT), CLK_OUT_2_SEL (out, harness CLK_SELECT), CLK_OUT_3_SEL (out, harness CLK_SELECT), CLK_OUT_4_SEL (out, harness CLK_SELECT), CLK_OUT_5_SEL (out, harness CLK_SELECT), CLK_OUT_6_SEL (out, harness CLK_SELECT), CLK_OUT_7_SEL (out, harness CLK_SELECT), DESER_CSn (in), DESER_MISO (out), DESER_MOSI (in), DESER_SCK (in), DESER_~{OE} (in), TERM_EN_[0..7] (out)

### Harnesses
CLK_SELECT: SEL0, SEL1, SEL2

### Nets
GND: C23.1 C24.1 C25.1 C26.1 IC4.8(GND) IC5.8(GND) IC6.8(GND) IC7.8(GND) LD5.1(C) LD6.1(C) LD7.1(C) LD8.1(C) LD9.1(C) LD10.1(C) LD11.1(C) LD12.1(C) LD13.1(C) LD14.1(C) LD15.1(C) LD16.1(C) LD17.1(C) LD18.1(C) LD19.1(C) LD20.1(C) LD21.1(C) LD22.1(C) LD23.1(C) LD24.1(C) LD25.1(C) LD26.1(C) LD27.1(C) LD28.1(C)
P3V3: C23.2 C24.2 C25.2 C26.2 IC4.10(~{SRCLR}) IC4.16(VCC) IC5.10(~{SRCLR}) IC5.16(VCC) IC6.10(~{SRCLR}) IC6.16(VCC) IC7.10(~{SRCLR}) IC7.16(VCC)
DESER0_QA: IC4.15(QA) R46.1 R51.2
DESER0_QB: IC4.1(QB) R47.1 R54.2
DESER0_QC: IC4.2(QC) R48.1 R56.2
DESER0_QD: IC4.3(QD) R49.1 R57.2
DESER0_QE: IC4.4(QE) R50.1 R58.2
DESER0_QF: IC4.5(QF) R52.1 R59.2
DESER0_QG: IC4.6(QG) R53.1 R60.2
DESER0_QH: IC4.7(QH) R55.1 R61.2
DESER0_QH': IC4.9(QH') IC5.14(SER)
DESER1_QA: IC5.15(QA) R62.2 R64.1
DESER1_QB: IC5.1(QB) R63.2 R66.1
DESER1_QC: IC5.2(QC) R65.2 R67.1
DESER1_QD: IC5.3(QD) R68.2 R69.1
DESER1_QE: IC5.4(QE) R70.1 R71.2
DESER1_QF: IC5.5(QF) R72.1 R74.2
DESER1_QG: IC5.6(QG) R73.1 R76.2
DESER1_QH: IC5.7(QH) R75.1 R77.2
DESER1_QH': IC5.9(QH') IC6.14(SER)
DESER2_QA: IC6.15(QA) R78.2 R84.1
DESER2_QB: IC6.1(QB) R79.2 R86.1
DESER2_QC: IC6.2(QC) R80.2 R87.1
DESER2_QD: IC6.3(QD) R81.2 R89.1
DESER2_QE: IC6.4(QE) R82.2 R90.1
DESER2_QF: IC6.5(QF) R83.2 R91.1
DESER2_QG: IC6.6(QG) R85.2 R92.1
DESER2_QH: IC6.7(QH) R88.2 R93.1
DESER2_QH': IC6.9(QH') IC7.14(SER)
DESER3_QA: IC7.15(QA) R101.1
DESER3_QB: IC7.1(QB) R94.1
DESER3_QC: IC7.2(QC) R95.1
DESER3_QD: IC7.3(QD) R96.1
DESER3_QE: IC7.4(QE) R97.1
DESER3_QF: IC7.5(QF) R98.1
DESER3_QG: IC7.6(QG) R99.1
DESER3_QH: IC7.7(QH) R100.1
DESER_CSn: IC4.12(RCLK) IC5.12(RCLK) IC6.12(RCLK) IC7.12(RCLK) ; port DESER_CSn
DESER_MISO: IC7.9(QH') ; port DESER_MISO
DESER_MOSI: IC4.14(SER) ; port DESER_MOSI
DESER_~{OE}: IC4.13(~{OE}) IC5.13(~{OE}) IC6.13(~{OE}) IC7.13(~{OE}) ; port DESER_~{OE}
DESER_SCK: IC4.11(SRCLK) IC5.11(SRCLK) IC6.11(SRCLK) IC7.11(SRCLK) ; port DESER_SCK
OUT_0_SEL_0: R53.2 ; port CLK_OUT_0_SEL.SEL0
OUT_0_SEL_1: R55.2 ; port CLK_OUT_0_SEL.SEL1
OUT_0_SEL_2: R46.2 ; port CLK_OUT_0_SEL.SEL2
OUT_1_SEL_0: R49.2 ; port CLK_OUT_1_SEL.SEL0
OUT_1_SEL_1: R50.2 ; port CLK_OUT_1_SEL.SEL1
OUT_1_SEL_2: R52.2 ; port CLK_OUT_1_SEL.SEL2
OUT_2_SEL_0: R64.2 ; port CLK_OUT_2_SEL.SEL0
OUT_2_SEL_1: R47.2 ; port CLK_OUT_2_SEL.SEL1
OUT_2_SEL_2: R48.2 ; port CLK_OUT_2_SEL.SEL2
OUT_3_SEL_0: R72.2 ; port CLK_OUT_3_SEL.SEL0
OUT_3_SEL_1: R73.2 ; port CLK_OUT_3_SEL.SEL1
OUT_3_SEL_2: R75.2 ; port CLK_OUT_3_SEL.SEL2
OUT_4_SEL_0: R67.2 ; port CLK_OUT_4_SEL.SEL0
OUT_4_SEL_1: R69.2 ; port CLK_OUT_4_SEL.SEL1
OUT_4_SEL_2: R70.2 ; port CLK_OUT_4_SEL.SEL2
OUT_5_SEL_0: R93.2 ; port CLK_OUT_5_SEL.SEL0
OUT_5_SEL_1: R84.2 ; port CLK_OUT_5_SEL.SEL1
OUT_5_SEL_2: R66.2 ; port CLK_OUT_5_SEL.SEL2
OUT_6_SEL_0: R92.2 ; port CLK_OUT_6_SEL.SEL0
OUT_6_SEL_1: R90.2 ; port CLK_OUT_6_SEL.SEL1
OUT_6_SEL_2: R91.2 ; port CLK_OUT_6_SEL.SEL2
OUT_7_SEL_0: R89.2 ; port CLK_OUT_7_SEL.SEL0
OUT_7_SEL_1: R86.2 ; port CLK_OUT_7_SEL.SEL1
OUT_7_SEL_2: R87.2 ; port CLK_OUT_7_SEL.SEL2
TERM_EN_0: R101.2
TERM_EN_1: R100.2
TERM_EN_2: R99.2
TERM_EN_3: R98.2
TERM_EN_4: R97.2
TERM_EN_5: R96.2
TERM_EN_6: R95.2
TERM_EN_7: R94.2
NetLD5_2: LD5.2(A) R51.1
NetLD6_2: LD6.2(A) R54.1
NetLD7_2: LD7.2(A) R56.1
NetLD8_2: LD8.2(A) R57.1
NetLD9_2: LD9.2(A) R58.1
NetLD10_2: LD10.2(A) R59.1
NetLD11_2: LD11.2(A) R60.1
NetLD12_2: LD12.2(A) R61.1
NetLD13_2: LD13.2(A) R62.1
NetLD14_2: LD14.2(A) R63.1
NetLD15_2: LD15.2(A) R65.1
NetLD16_2: LD16.2(A) R68.1
NetLD17_2: LD17.2(A) R71.1
NetLD18_2: LD18.2(A) R74.1
NetLD19_2: LD19.2(A) R76.1
NetLD20_2: LD20.2(A) R77.1
NetLD21_2: LD21.2(A) R78.1
NetLD22_2: LD22.2(A) R79.1
NetLD23_2: LD23.2(A) R80.1
NetLD24_2: LD24.2(A) R81.1
NetLD25_2: LD25.2(A) R82.1
NetLD26_2: LD26.2(A) R83.1
NetLD27_2: LD27.2(A) R85.1
NetLD28_2: LD28.2(A) R88.1

### Buses and harness runs
bus TERM_EN_[0..7] = port TERM_EN_[0..7]

### Notes on the sheet
- Copyright WUT ISE 2024.
  This source describes Open Hardware and is licensed under the CERN-OHLW v2
  You may redistribute and modify this documentation and make products
  using it under the terms of the CERN-OHL-W v2 (https:/cern.ch/cern-ohl).
  This documentation is distributed WITHOUT ANY EXPRESS OR IMPLIED
  WARRANTY, INCLUDING OF MERCHANTABILITY, SATISFACTORY QUALITY
  AND FITNESS FOR A PARTICULAR PURPOSE. Please see the CERN-OHL-W v2
  for applicable conditions.
  Source location: https://github.com/elhep/8x8-crosspoint-switch/
  As per CERN-OHL-W v2 section 4.1, should You produce hardware based on
  these sources, You must maintain the Source Location visible on the
  external case of the 8x8 Cross-point Swicth or other product you make using
  this documentation.
- Project/Equipment
- Document
- Designer
- Drawn by
- Check.by
- Contact
- File
- Last Mod.
- Print Date
- Sheet
- Size
- A3
- of
- Rev

### Library data of the parts
C23-C26 = CC0402_100NF_50V_10%_X7R: Non-polarised capacitor; Part Description: SMD Multilayer Chip Ceramic Capacitor; Manufacturer: GENERIC; Manufacturer1 Part Number: GRM155R71H104KE14D; Voltage: 50V; TC: X7R; Tolerance: ±10%; Part Number: CC0402_100NF_50V_10%_X7R; Component Kind: Standard; Component Type: Standard; Pin Count: 2; Value: 100nF; Status: None; Manufacturer Part Number: CC0402_100NF_50V_10%_X7R; Case: 0402; Mounted: Yes; Socket: No; SMD: Yes; Sense: No; Manufacturer1 Example: MURATA; Manufacturer1 ComponentHeight: 0.55mm; HelpURL: \\cern.ch\dfs\Applications\Altium\Datasheets\CC0402_MURATA_GRM155R71H104KE14D.pdf; Author: CERN DEM MR; CreateDate: 6/30/2017; LatestRevisionDate: 6/30/2017
IC4-IC7 = SN74LV595APWT: 8-Bit Shift Register With 3-State Output Register; Part Description: 8-Bit Shift Register with 3-State Output Registers; Manufacturer: TEXAS INSTRUMENTS; PressFit: No; Bonding: No; Part Number: SN74LV595APWT; Component Kind: Standard; Component Type: Standard; Device: SN74LV595APWT; PackageDescription: SOP, 0.65mm Pitch; 16 Pin, 4.40mm W X 5.00mm L X 1.20mm H body, IPC Medium Density; Manufacturer Part Number: SN74LV595APWT; Pin Count: 16; Case: TSSOP16; Mounted: Yes; Socket: No; SMD: Yes; Sense: No; ComponentHeight: 1.2mm; Author: CERN DEM JLC; HelpURL: \\cern.ch\dfs\Applications\Altium\Datasheets\SN74LV595APWT.pdf; CreateDate: 5/10/2012; LatestRevisionDate: 5/10/2012
LD5-LD28 = LED_KINGBRIGHT_KP-1608CGCK: LED Green 1C 2A; Part Description: 1.6x0.8mm SMD Chip Green LED Lamp; PressFit: No; Bonding: No; Part Number: LED_KINGBRIGHT_KP-1608CGCK; Component Kind: Standard; Component Type: Standard; Color: Green; PackageDescription: SMT Green LED, Case 0603, Body L 1.60mm x W 0.80mm x H 1.10mm; Manufacturer: KINGBRIGHT; Manufacturer Part Number: KP-1608CGCK; Pin Count: 2; Case: 0603; Mounted: Yes; Socket: No; SMD: Yes; Sense: No; ComponentHeight: 1.1mm; HelpURL: \\cern.ch\dfs\Applications\Altium\Datasheets\LED_KINGBRIGHT_KP-1608CGCK.pdf; Author: CERN DEM HF; CreateDate: 10/1/2021; LatestRevisionDate: 10/1/2021
R46-R50 R52 R53 R55 R64 R66 R67 R69 R70 R72 R73 R75 R84 R86 R87 R89-R101 = R0402_2K2_1%_0.0625W_100PPM: Resistor - 1%; Part Description: General Purpose Thick Film Chip Resistor; Manufacturer: GENERIC; Manufacturer1 Part Number: 232270672202L; TC: ±100ppm/°C; PressFit: No; Part Number: R0402_2K2_1%_0.0625W_100PPM; Component Kind: Standard; Component Type: Standard; Pin Count: 2; Value: 2k2; Status: Not Recommended; Power: 0.0625W; Manufacturer Part Number: R0402_2K2_1%_0.0625W_100PPM; Case: 0402; Mounted: Yes; Sense: No; Socket: No; SMD: Yes; Manufacturer1 Example: YAGEO PHYCOMP; Manufacturer1 ComponentHeight: 0.4mm; HelpURL: \\cern.ch\dfs\Applications\Altium\Datasheets\R0402_Phycomp_RC0402.pdf; Author: CERN DEM JLC; CreateDate: 12/3/2007; LatestRevisionDate: 10/17/2012
R51 R54 R56-R63 R65 R68 R71 R74 R76-R83 R85 R88 = R0402_10K_1%_0.0625W_100PPM: Resistor - 1%; Part Description: General Purpose Thick Film Chip Resistor; Manufacturer: GENERIC; Manufacturer1 Part Number: 232270671003L; TC: ±100ppm/°C; PressFit: No; Part Number: R0402_10K_1%_0.0625W_100PPM; Component Kind: Standard; Component Type: Standard; Pin Count: 2; Value: 10k; Status: Not Recommended; Power: 0.0625W; Manufacturer Part Number: R0402_10K_1%_0.0625W_100PPM; Case: 0402; Mounted: Yes; Sense: No; Socket: No; SMD: Yes; Manufacturer1 Example: YAGEO PHYCOMP; Manufacturer1 ComponentHeight: 0.4mm; HelpURL: \\cern.ch\dfs\Applications\Altium\Datasheets\R0402_Phycomp_RC0402.pdf; Author: CERN DEM JLC; CreateDate: 12/3/2007; LatestRevisionDate: 10/17/2012

## Sheet DIOT_P1.SchDoc: DIOT connector
size A3; Author: M.Beldyga; CompanyName: WUT ISE; DrawnBy: M.Beldyga; Organization: WUT ISE; Address1: PW ISE; Address2: Nowowiejska 15/19 00-665 Warsaw; Address3: micbeldyga@gmail.com; SheetNumber: 6; SheetTotal: 8; ModifiedBy: -; CheckedDate: -; DivGrp: WUT ISE; Designer: M.Beldyga; ModifiedDate: -; ProjectName: Sensor Box
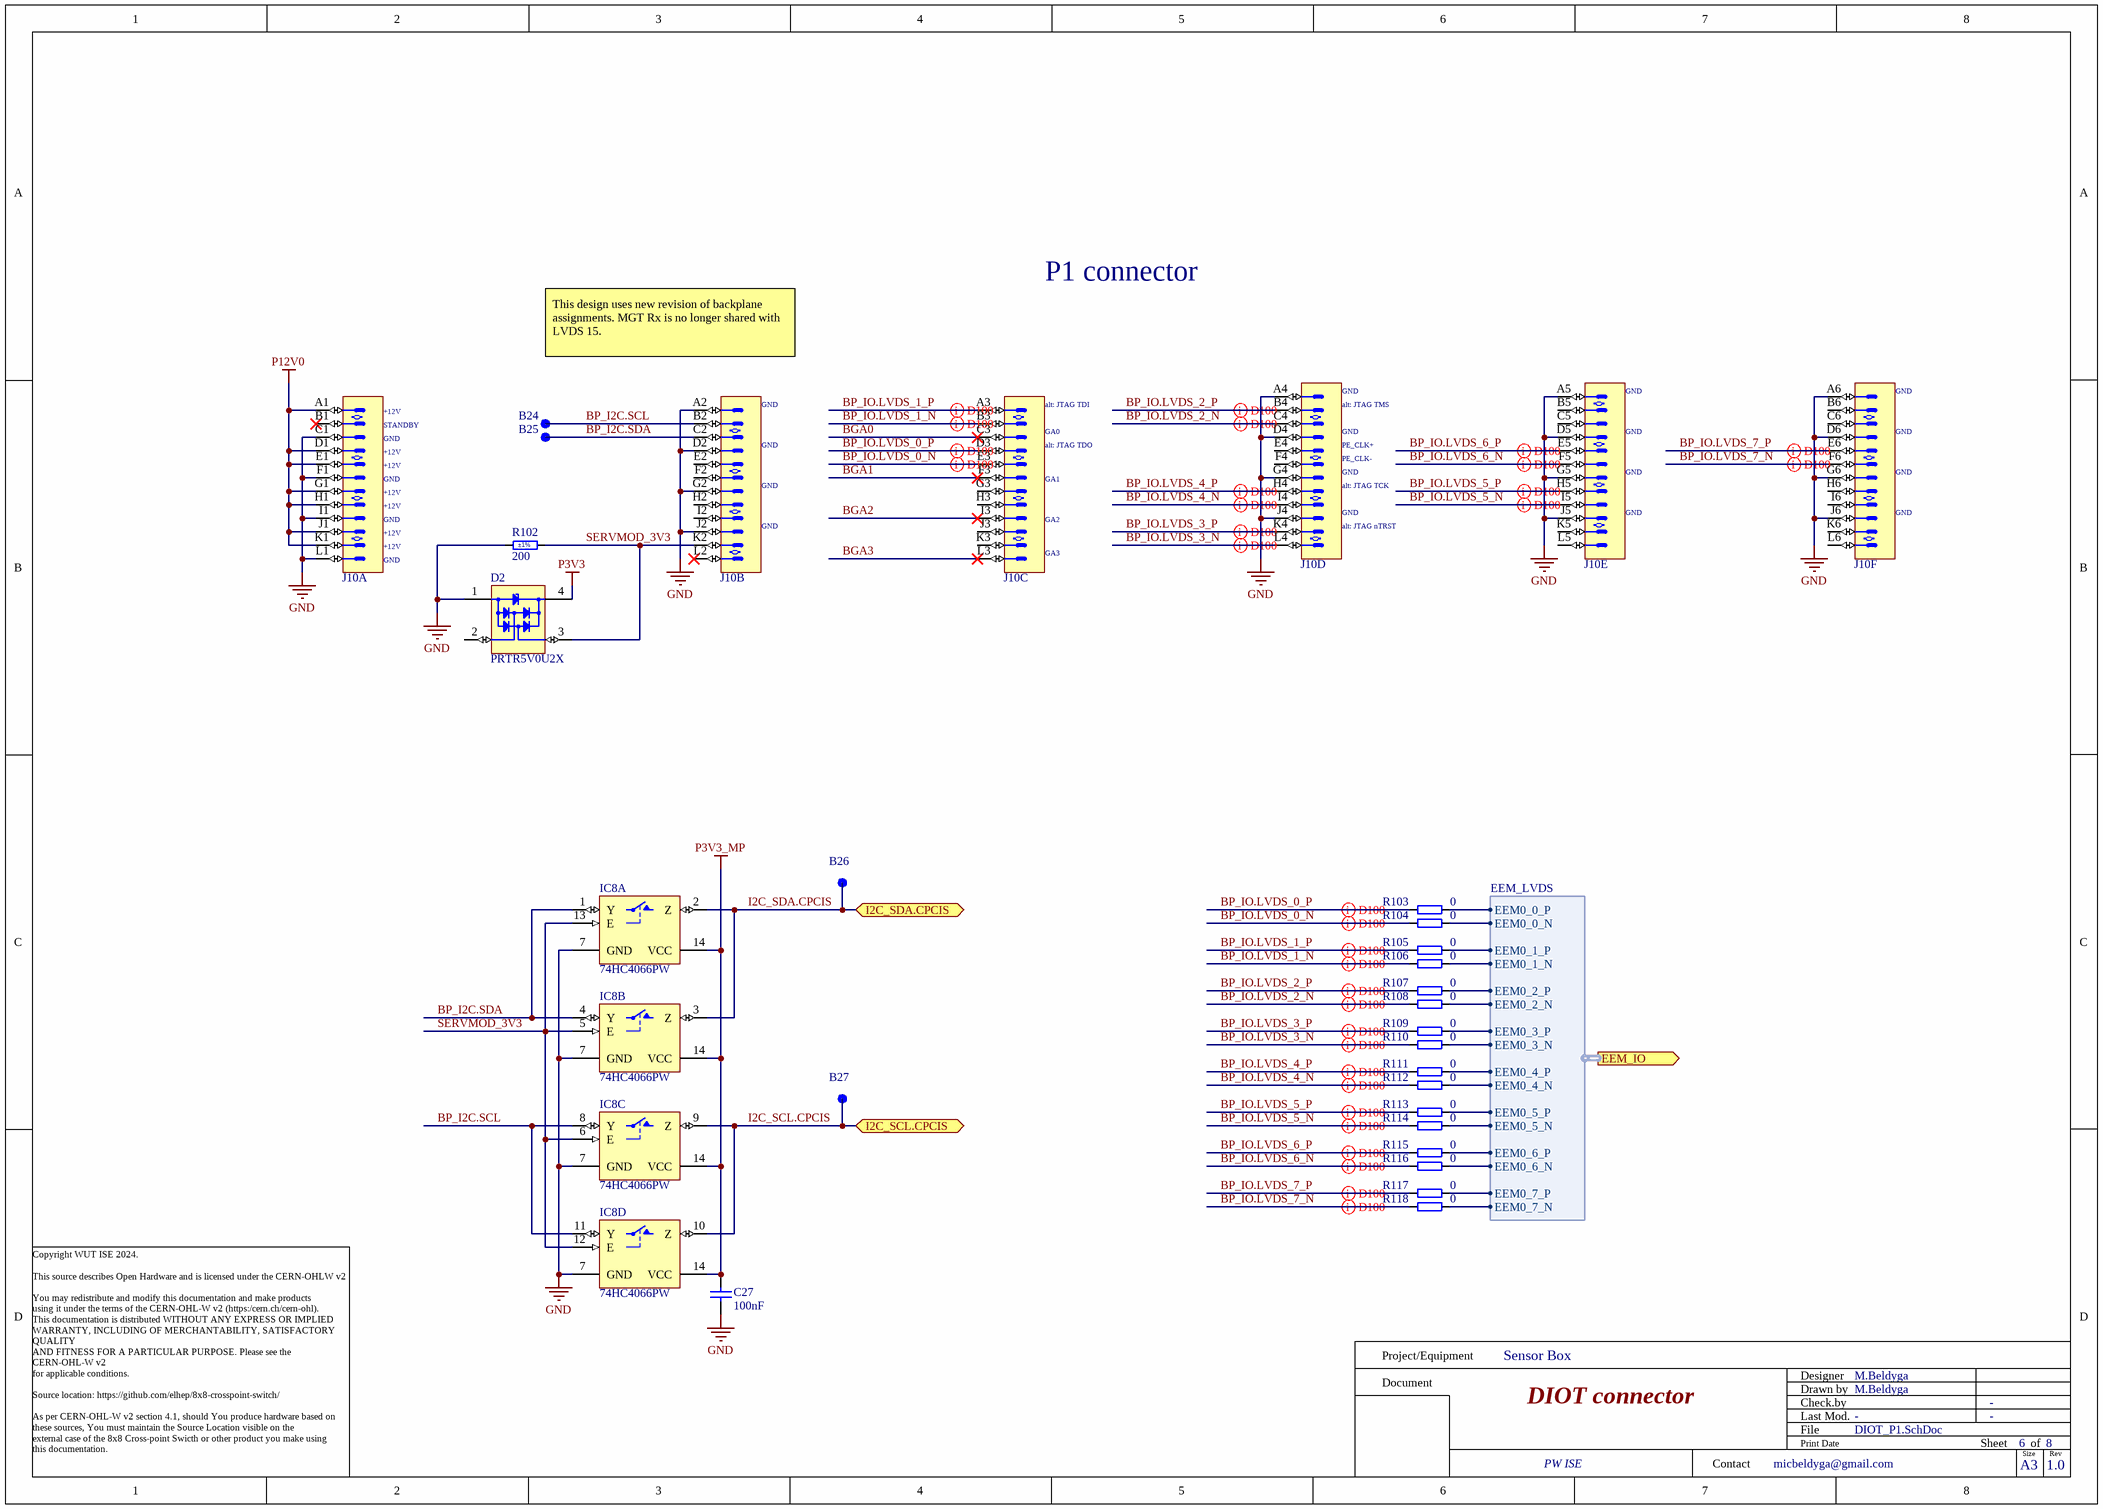
[diagram p5: DIOT_P1.SchDoc]

### Parts
B24  SMD Pad  [C100]  (value not drawn)  (no BOM)
B25  SMD Pad  [C100]  (value not drawn)  (no BOM)
B26  SMD Pad  [C100]  (value not drawn)  (no BOM)
B27  SMD Pad  [C100]  (value not drawn)  (no BOM)
C27  100nF  [CAPC1005X55N]
D2  PRTR5V0U2X  [SOT190P230X110-4N]
IC8  74HC4066PW  [SOP65P640X110-14N]  (parts A,B,C,D of 4)
J10  AirMax VS  [AMPHENOL_10052825-101LF]  (value not drawn)  (parts A,B,C,D,E,F of 6)
R102  200  Tolerance: ±1%  [RESC1608X55N]
R103  0  [RESC1005X40N]
R104  0  [RESC1005X40N]
R105  0  [RESC1005X40N]
R106  0  [RESC1005X40N]
R107  0  [RESC1005X40N]
R108  0  [RESC1005X40N]
R109  0  [RESC1005X40N]
R110  0  [RESC1005X40N]
R111  0  [RESC1005X40N]
R112  0  [RESC1005X40N]
R113  0  [RESC1005X40N]
R114  0  [RESC1005X40N]
R115  0  [RESC1005X40N]
R116  0  [RESC1005X40N]
R117  0  [RESC1005X40N]
R118  0  [RESC1005X40N]

### Ports
EEM_IO (out, harness EEM_LVDS), I2C_SCL.CPCIS (bidir), I2C_SDA.CPCIS (bidir)

### Harnesses
EEM_LVDS: EEM0_0_P, EEM0_0_N, EEM0_1_P, EEM0_1_N, EEM0_2_P, EEM0_2_N, EEM0_3_P, EEM0_3_N, EEM0_4_P, EEM0_4_N, EEM0_5_P, EEM0_5_N, EEM0_6_P, EEM0_6_N, EEM0_7_P, EEM0_7_N

### Nets
GND: C27.1 D2.1(GND) IC8.7(GND) J10.A2 J10.A4 J10.A5 J10.A6 J10.C1 J10.D2 J10.D4 J10.D5 J10.D6 J10.F1 J10.G2 J10.G4 J10.G5 J10.G6 J10.I1 J10.J2 J10.J4 J10.J5 J10.J6 J10.L1 R102.1
P3V3: D2.4(VCC)
P3V3_MP: C27.2 IC8.14(VCC)
P12V0: J10.A1 J10.D1 J10.E1 J10.G1 J10.H1 J10.J1 J10.K1
BGA0: J10.C3
BGA1: J10.F3
BGA2: J10.I3
BGA3: J10.L3
BP_I2C.SCL: B24.1 IC8.8(Y) IC8.11(Y) J10.B2
BP_I2C.SDA: B25.1 IC8.1(Y) IC8.4(Y) J10.C2
BP_IO.LVDS_0_N: J10.E3 R104.1
BP_IO.LVDS_0_P: J10.D3 R103.1
BP_IO.LVDS_1_N: J10.B3 R106.1
BP_IO.LVDS_1_P: J10.A3 R105.1
BP_IO.LVDS_2_N: J10.C4 R108.1
BP_IO.LVDS_2_P: J10.B4 R107.1
BP_IO.LVDS_3_N: J10.L4 R110.1
BP_IO.LVDS_3_P: J10.K4 R109.1
BP_IO.LVDS_4_N: J10.I4 R112.1
BP_IO.LVDS_4_P: J10.H4 R111.1
BP_IO.LVDS_5_N: J10.I5 R114.1
BP_IO.LVDS_5_P: J10.H5 R113.1
BP_IO.LVDS_6_N: J10.F5 R116.1
BP_IO.LVDS_6_P: J10.E5 R115.1
BP_IO.LVDS_7_N: J10.F6 R118.1
BP_IO.LVDS_7_P: J10.E6 R117.1
EEM0_0_N: R104.2 ; port EEM_IO.EEM0_0_N
EEM0_0_P: R103.2 ; port EEM_IO.EEM0_0_P
EEM0_1_N: R106.2 ; port EEM_IO.EEM0_1_N
EEM0_1_P: R105.2 ; port EEM_IO.EEM0_1_P
EEM0_2_N: R108.2 ; port EEM_IO.EEM0_2_N
EEM0_2_P: R107.2 ; port EEM_IO.EEM0_2_P
EEM0_3_N: R110.2 ; port EEM_IO.EEM0_3_N
EEM0_3_P: R109.2 ; port EEM_IO.EEM0_3_P
EEM0_4_N: R112.2 ; port EEM_IO.EEM0_4_N
EEM0_4_P: R111.2 ; port EEM_IO.EEM0_4_P
EEM0_5_N: R114.2 ; port EEM_IO.EEM0_5_N
EEM0_5_P: R113.2 ; port EEM_IO.EEM0_5_P
EEM0_6_N: R116.2 ; port EEM_IO.EEM0_6_N
EEM0_6_P: R115.2 ; port EEM_IO.EEM0_6_P
EEM0_7_N: R118.2 ; port EEM_IO.EEM0_7_N
EEM0_7_P: R117.2 ; port EEM_IO.EEM0_7_P
I2C_SCL.CPCIS: B27.1 IC8.9(Z) IC8.10(Z) ; port I2C_SCL.CPCIS  [project net I2C0_SCL]
I2C_SDA.CPCIS: B26.1 IC8.2(Z) IC8.3(Z) ; port I2C_SDA.CPCIS  [project net I2C0_SDA]
SERVMOD_3V3: D2.3(I/O2) IC8.5(E) IC8.6(E) IC8.12(E) IC8.13(E) J10.K2 R102.2

Not connected (* = marked no-connect by the designer): D2 2(I/O1); J10 B1* B5 B6 C5 C6 E2 E4 F2 F4 G3 H2 H3 H6 I2 I6 J3 K3 K5 K6 L2* L5 L6

### Layout directives
differential pair; net class D100: BP_IO.LVDS_0_N, BP_IO.LVDS_0_P, BP_IO.LVDS_1_N, BP_IO.LVDS_1_P, BP_IO.LVDS_2_N, BP_IO.LVDS_2_P, BP_IO.LVDS_3_N, BP_IO.LVDS_3_P, BP_IO.LVDS_4_N, BP_IO.LVDS_4_P, BP_IO.LVDS_5_N, BP_IO.LVDS_5_P, BP_IO.LVDS_6_N, BP_IO.LVDS_6_P, BP_IO.LVDS_7_N, BP_IO.LVDS_7_P

### Notes on the sheet
- P1 connector
- This design uses new revision of backplane assignments. MGT Rx is no longer shared with LVDS 15.
- (near J10) +12V
- (near J10) STANDBY
- (near J10) GND
- (near J10) alt: JTAG TDI
- (near J10) alt: JTAG TDO
- (near J10) GA0
- (near J10) alt: JTAG TMS
- (near J10) PE_CLK+
- (near J10) GA1
- (near J10) alt: JTAG TCK
- (near J10) PE_CLK-
- (near J10) GA2
- (near J10) GA3
- (near J10) alt: JTAG nTRST
- Copyright WUT ISE 2024.
  This source describes Open Hardware and is licensed under the CERN-OHLW v2
  You may redistribute and modify this documentation and make products
  using it under the terms of the CERN-OHL-W v2 (https:/cern.ch/cern-ohl).
  This documentation is distributed WITHOUT ANY EXPRESS OR IMPLIED
  WARRANTY, INCLUDING OF MERCHANTABILITY, SATISFACTORY QUALITY
  AND FITNESS FOR A PARTICULAR PURPOSE. Please see the CERN-OHL-W v2
  for applicable conditions.
  Source location: https://github.com/elhep/8x8-crosspoint-switch/
  As per CERN-OHL-W v2 section 4.1, should You produce hardware based on
  these sources, You must maintain the Source Location visible on the
  external case of the 8x8 Cross-point Swicth or other product you make using
  this documentation.
- Project/Equipment
- Document
- Designer
- Drawn by
- Check.by
- Contact
- File
- Last Mod.
- Print Date
- Sheet
- Size
- A3
- of
- Rev

### Library data of the parts
B24-B27 = SMD_PAD_D1MM: Pad; Part Description: 1mm Diameter SMD Pad; Mounted: No; Part Number: SMD_PAD_D1MM; Component Type: Standard (No BOM); Pin Count: 1; Family: SMD Pad; Socket: No; SMD: Yes; Sense: No; Status: None; ComponentHeight: 0mm; HelpURL: Undefined; Author: CERN DEM JLC; CreateDate: 10/10/2017; LatestRevisionDate: 10/10/2017; PackageDescription: 1mm Diameter SMD Pad
C27 = CC0402_100NF_50V_10%_X7R: as C23-C26 on sheet Crosspoint_control; Part Number: CC0402_100NF_50V_10%_X7R; Component Kind: Standard; Component Type: Standard; Pin Count: 2; Value: 100nF; Status: None; Manufacturer Part Number: CC0402_100NF_50V_10%_X7R; Case: 0402; Mounted: Yes; Socket: No; SMD: Yes; Sense: No; Manufacturer1 Example: MURATA; Manufacturer1 ComponentHeight: 0.55mm; HelpURL: \\cern.ch\dfs\Applications\Altium\Datasheets\CC0402_MURATA_GRM155R71H104KE14D.pdf; Author: CERN DEM MR; CreateDate: 6/30/2017; LatestRevisionDate: 6/30/2017
D2 = PRTR5V0U2X: Ultra Low Capacitance Double Rail-to-Rail ESD Protection Diode; Part Description: Ultra Low Capacitance (1pF) Double Rail-to-Rail ESD Protection Diode (8kV); Manufacturer: NXP SEMICONDUCTORS; Voltage: 5.5V; PressFit: No; Bonding: No; Part Number: PRTR5V0U2X; Component Kind: Standard; Component Type: Standard; Device: PRTR5V0U2X; PackageDescription: SOT143B, SOT, 1.90mm Pitch; 4 Pin, 1.30mm W X 2.90mm L X 1.10mm H body, IPC Medium Density; Manufacturer Part Number: PRTR5V0U2X; Pin Count: 4; Case: SOT143B; Mounted: Yes; Socket: No; SMD: Yes; Sense: No; ComponentHeight: 1.1mm; HelpURL: \\cern.ch\dfs\Applications\Altium\Datasheets\PRTR5V0U2X.pdf; Author: CERN DEM JLC; CreateDate: 3/22/2011; LatestRevisionDate: 3/22/2011
IC8 = 74HC4066PW: Quad Single-Pole Single-Throw Analog Switch; Manufacturer: NXP SEMICONDUCTORS; PressFit: No; Bonding: No; Part Number: 74HC4066PW; Component Kind: Standard; Component Type: Standard; Device: 74HC4066PW; PackageDescription: SOP, 0.65mm Pitch; 14 Pin, 4.40mm W X 5.00mm L X 1.20mm H body, IPC Medium Density; Part Description: Quad Single-Pole Single-Throw Analog Switch; Manufacturer Part Number: 74HC4066PW; Pin Count: 14; Case: TSSOP14; Mounted: Yes; Socket: No; SMD: Yes; Sense: No; ComponentHeight: 1.1mm; Author: CERN DEM JLC; HelpURL: \\cern.ch\dfs\Applications\Altium\Datasheets\74HC4066PW.pdf; CreateDate: 11/19/2014; LatestRevisionDate: 11/19/2014
J10 = AMPHENOL_10052825-101LF: 72 Contacts Header, 6 Columns, 4 Pairs per Column; Part Description: 72 Contacts, 2mm Pitch, 6 Columns, 4 Pairs per Column, 4 Walls, Right Angle Header; Part Number: AMPHENOL_10052825-101LF; Component Kind: Standard; Component Type: Standard; Pin Count: 72; Family: AirMax VS; Mounted: Yes; Socket: No; SMD: No; PressFit: Yes; Sense: No; Status: None; Manufacturer: AMPHENOL; Manufacturer Part Number: 10052825-101LF; ComponentHeight: 15.35mm; HelpURL: \\cern.ch\dfs\Applications\Altium\Datasheets\AMPHENOL_10052825-101LF.pdf; ComponentLink1URL: \\cern.ch\dfs\Applications\Altium\Datasheets\AMPHENOL_10052825-101LF_Application.pdf; ComponentLink1Description: Application; Author: CERN DEM MR; CreateDate: 2/19/2018; LatestRevisionDate: 2/19/2018
R102 = R0603_200R_1%_0.1W_100PPM: Resistor - 1%; Part Description: General Purpose Thick Film Chip Resistor; Manufacturer: GENERIC; Manufacturer1 Part Number: NRC06F2000TRF; Power: 0.1W; TC: ±100ppm/°C; PressFit: No; Part Number: R0603_200R_1%_0.1W_100PPM; Component Kind: Standard; Component Type: Standard; Pin Count: 2; Value: 200; Status: Preferred; Manufacturer Part Number: R0603_200R_1%_0.1W_100PPM; Case: 0603; Mounted: Yes; Sense: No; Socket: No; SMD: Yes; Manufacturer1 Example: NIC COMPONENT; Manufacturer1 ComponentHeight: 0.55mm; HelpURL: \\cern.ch\dfs\Applications\Altium\Datasheets\R0603_NIC_NRC.pdf; Author: CERN DEM JLC; CreateDate: 12/3/2007; LatestRevisionDate: 3/13/2008
R103-R118 = R0402_0R_JUMPER: Resistor; Part Description: 1A (0.05R Max DC Resistance) Zero Ohm Jumper; Manufacturer: GENERIC; Manufacturer1 Part Number: 232270591001L; PressFit: No; Part Number: R0402_0R_JUMPER; Component Kind: Standard; Component Type: Standard; Pin Count: 2; Value: 0; Status: Not Recommended; Manufacturer Part Number: R0402_0R_JUMPER; Case: 0402; Mounted: Yes; Sense: No; Socket: No; SMD: Yes; Manufacturer1 Example: YAGEO PHYCOMP; Manufacturer1 ComponentHeight: 0.4mm; HelpURL: \\cern.ch\dfs\Applications\Altium\Datasheets\R0402_Phycomp_RC0402.pdf; Author: CERN DEM JLC; CreateDate: 12/3/2007; LatestRevisionDate: 10/17/2012